# EasyEDA Pro project BQ76930_2023-08-07_15-58-00(1).eprj

# Schematic 原理图5.0
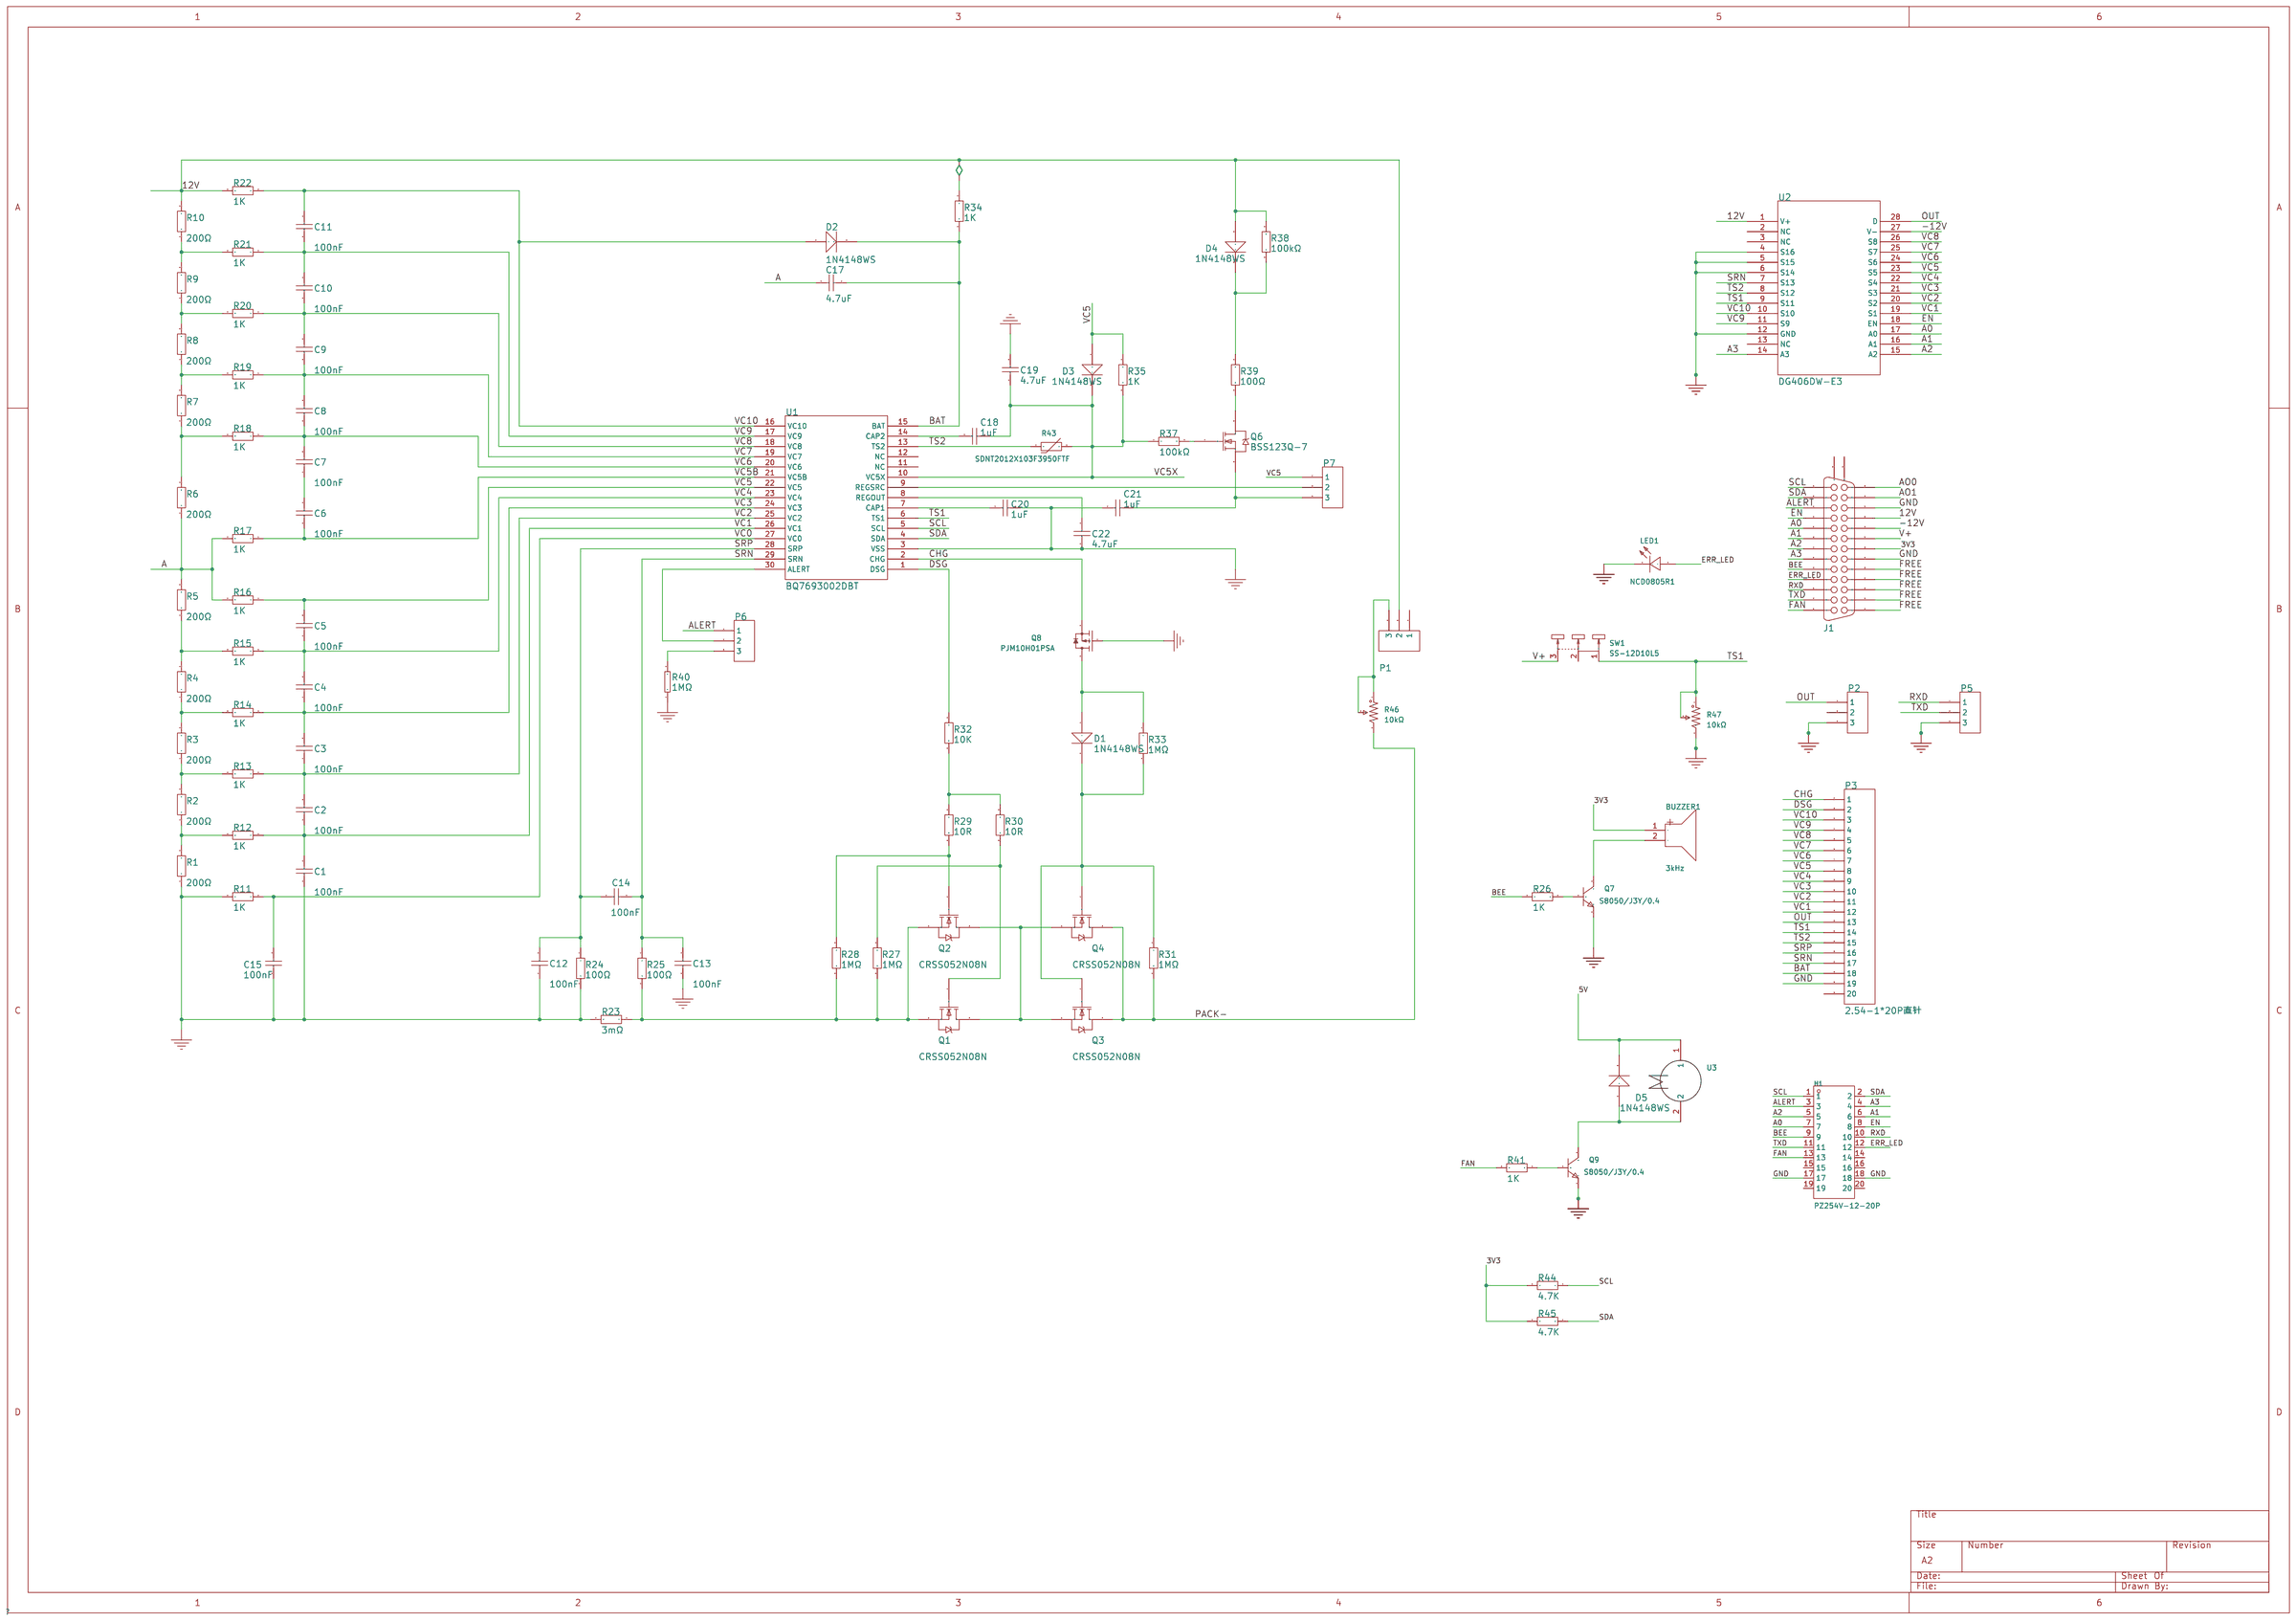
[diagram p0: schematic sheet]

## Parts
BUZZER1  3kHz  [BUZ-TH_BD9.0-P5.00-D0.6-FD]
C1  100nF  [C1206]
C2  100nF  [C1206]
C3  100nF  [C1206]
C4  100nF  [C1206]
C5  100nF  [C1206]
C6  100nF  [C1206]
C7  100nF  [C1206]
C8  100nF  [C1206]
C9  100nF  [C1206]
C10  100nF  [C1206]
C11  100nF  [C1206]
C12  100nF  [C1206]
C13  100nF  [C1206]
C14  100nF  [C1206]
C15  100nF  [C1206]
C17  4.7uF  [C1206]
C18  1uF  [C1206]
C19  4.7uF  [C1206]
C20  1uF  [C1206]
C21  1uF  [C1206]
C22  4.7uF  [C1206]
D1  1N4148WS  [SOD-323_L1.8-W1.3-LS2.5-RD]
D2  1N4148WS  [SOD-323_L1.8-W1.3-LS2.5-RD]
D3  1N4148WS  [SOD-323_L1.8-W1.3-LS2.5-RD]
D4  1N4148WS  [SOD-323_L1.8-W1.3-LS2.5-RD]
D5  1N4148WS  [SOD-323_L1.8-W1.3-LS2.5-RD]
H1  PZ254V-12-20P  [HDR-TH_20P-P2.54-V-M-R2-C10-S2.54]
J1  Connector 26  [TSSOP-30_L7.8-W4.4-P0.50-LS6.4-BL]  (no BOM)
LED1  NCD0805R1  [LED0805-RD_RED]
P1  EDG-2.54-3P  [HDR-TH_3P-P2.54-V-M]
P2  EDG-2.54-3P  [HDR-TH_3P-P2.54-V-M]
P3  2.54-1*20P直针  [HDR-TH_20P-P2.54-V-M-1]
P5  EDG-2.54-3P  [HDR-TH_3P-P2.54-V-M]
P6  EDG-2.54-3P  [HDR-TH_3P-P2.54-V-M]
P7  EDG-2.54-3P  [HDR-TH_3P-P2.54-V-M]
Q1  CRSS052N08N  [TO-263-2_L10.1-W9.1-P5.08-LS15.2-TL]
Q2  CRSS052N08N  [TO-263-2_L10.1-W9.1-P5.08-LS15.2-TL]
Q3  CRSS052N08N  [TO-263-2_L10.1-W9.1-P5.08-LS15.2-TL]
Q4  CRSS052N08N  [TO-263-2_L10.1-W9.1-P5.08-LS15.2-TL]
Q6  BSS123Q-7  [SOT-23-3_L2.9-W1.3-P1.90-LS2.4-BR]
Q7  S8050/J3Y/0.4  [SOT-23-3_L2.9-W1.3-P1.90-LS2.4-BR]
Q8  PJM10H01PSA  [SOT-23-3_L2.9-W1.3-P0.95-LS2.4-BR]
Q9  S8050/J3Y/0.4  [SOT-23-3_L2.9-W1.3-P1.90-LS2.4-BR]
R1  200Ω  [R1206]
R2  200Ω  [R1206]
R3  200Ω  [R1206]
R4  200Ω  [R1206]
R5  200Ω  [R1206]
R6  200Ω  [R1206]
R7  200Ω  [R1206]
R8  200Ω  [R1206]
R9  200Ω  [R1206]
R10  200Ω  [R1206]
R11  1K  [R1206]
R12  1K  [R1206]
R13  1K  [R1206]
R14  1K  [R1206]
R15  1K  [R1206]
R16  1K  [R1206]
R17  1K  [R1206]
R18  1K  [R1206]
R19  1K  [R1206]
R20  1K  [R1206]
R21  1K  [R1206]
R22  1K  [R1206]
R23  3mΩ  [R2512]
R24  100Ω  [R1206]
R25  100Ω  [R1206]
R26  1K  [R1206]
R27  1MΩ  [R1206]
R28  1MΩ  [R1206]
R29  10R  [R1206]
R30  10R  [R1206]
R31  1MΩ  [R1206]
R32  10K  [R1206]
R33  1MΩ  [R1206]
R34  1K  [R1206]
R35  1K  [R1206]
R37  100kΩ  [R1206]
R38  100kΩ  [R1206]
R39  100Ω  [R1206]
R40  1MΩ  [R1206]
R41  1K  [R1206]
R43  SDNT2012X103F3950FTF  [R0805]
R44  4.7K  [R1206]
R45  4.7K  [R1206]
R46  10kΩ  [RES-ADJ-TH_3P-L10.0-W10.0-P2.50-L]
R47  10kΩ  [RES-ADJ-TH_3P-L10.0-W10.0-P2.50-L]
SW1  SS-12D10L5  [SW-TH_SS-12D10L5]
U1  BQ7693002DBT  [bq76930底座（新）]
U2  DG406DW-E3  [SOIC-28_L17.9-W7.5-P1.27-LS10.3-BL]
U3  -  [电机（风扇）]

## Library data of the parts
BUZZER1 = HNB09A03: 驱动方式:有源(内含驱动线路);构造类型:电磁式;额定电压:3V;工作电压:1.5V~4.5V;消耗电流:30mA;频率:3kHz;声压(SPL):85dB@10cm;直径(φD):9mm;长度:-;宽度:-;高度:5.5mm;工作温度:-20℃~+70℃;; LCSC Part Name: 电磁式有源一体蜂鸣器HNB09A03; Supplier Part: C96102; Manufacturer: 华能; Supplier Footprint: 插件,D=9mm; JLCPCB Part Class: 扩展库; Datasheet: https://atta.szlcsc.com/upload/public/pdf/source/20170522/1495448326172.pdf; Supplier: LCSC; Oscillator Circuit: 有源(内含驱动线路); Technology Type: 电磁式; Rated Voltage: 3V; Operating Voltage: 1.5V~4.5V; Current Consumption: 30mA; Sound Pressure Level (SPL): 85dB@10cm; Diameter (φD): 9mm; Height: 5.5mm; Operating Temperature: -20℃~+70℃
C1-C15 = CL31B104KBCNNNC: 容值:100nF;精度:±10%;额定电压:50V;材质(温度系数):X7R;; LCSC Part Name: 100nF ±10% 50V; Supplier Part: C24497; Manufacturer: SAMSUNG(三星); Supplier Footprint: 1206; JLCPCB Part Class: Basic Part; Datasheet: https://atta.szlcsc.com/upload/public/pdf/source/20160103/1457707712356.pdf; Supplier: LCSC; Tolerance: ±10%; Voltage Rated: 50V; Temperature Coefficient: X7R; Design Item ID: Cap; Library Name: Miscellaneous Devices; Published: 8-Jun-2000; LatestRevisionDate: 17-Jul-2002; LatestRevisionNote: Re-released for DXP Platform.; PackageReference: RAD-0.3; Publisher: Altium Limited; PackageDescription: Radial Cap, Thru-Hole; 2 Leads; 0.3 in Pin Spacing
C17 C19 C22 = CL31B475KBHNNNE: 容值:4.7uF;精度:±10%;额定电压:50V;材质(温度系数):X7R;; LCSC Part Name: 4.7uF ±10% 50V; Supplier Part: C51205; Manufacturer: SAMSUNG(三星); Supplier Footprint: 1206; JLCPCB Part Class: Extended Part; Datasheet: https://atta.szlcsc.com/upload/public/pdf/source/20160103/1457707732693.pdf; Supplier: LCSC; Tolerance: ±10%; Voltage Rated: 50V; Temperature Coefficient: X7R; Design Item ID: Cap; Library Name: Miscellaneous Devices; Published: 8-Jun-2000; LatestRevisionDate: 17-Jul-2002; LatestRevisionNote: Re-released for DXP Platform.; PackageReference: RAD-0.3; Publisher: Altium Limited; PackageDescription: Radial Cap, Thru-Hole; 2 Leads; 0.3 in Pin Spacing
C18 C20 C21 = CL31B105KBHNNNE: 容值:1uF;精度:±10%;额定电压:50V;材质(温度系数):X7R;; LCSC Part Name: 1uF ±10% 50V; Supplier Part: C1848; Manufacturer: SAMSUNG(三星); Supplier Footprint: 1206; JLCPCB Part Class: Basic Part; Datasheet: https://atta.szlcsc.com/upload/public/pdf/source/20160103/1457707700211.pdf; Supplier: LCSC; Tolerance: ±10%; Voltage Rated: 50V; Temperature Coefficient: X7R; Design Item ID: Cap; Library Name: Miscellaneous Devices; Published: 8-Jun-2000; LatestRevisionDate: 17-Jul-2002; LatestRevisionNote: Re-released for DXP Platform.; PackageReference: RAD-0.3; Publisher: Altium Limited; PackageDescription: Radial Cap, Thru-Hole; 2 Leads; 0.3 in Pin Spacing
D1-D5 = 1N4148WS_C2128: 二极管配置:独立式;功率:200mW;直流反向耐压(Vr):100V;平均整流电流(Io):150mA;正向压降(Vf):1.25V@150mA;反向电流(Ir):1uA@75V;反向恢复时间(trr):4ns;工作温度:+150℃@(Tj);; LCSC Part Name: 100V 150mA 4ns T4; Supplier Part: C2128; Manufacturer: CJ(江苏长电/长晶); Supplier Footprint: SOD-323; JLCPCB Part Class: Basic Part; Datasheet: https://atta.szlcsc.com/upload/public/pdf/source/20140809/1457707208178.pdf; Supplier: LCSC; Diode Configuration: 独立式; Power Dissipation: 200mW; Reverse Voltage (Vr): 100V; Average Rectified Current (Io): 150mA; Forward Voltage (Vf@If): 1.25V@150mA; Reverse Leakage Current: 1uA@75V; Reverse Recovery Time (trr): 4ns; Operating Temperature: +150℃@(Tj); Design Item ID: Diode 1N4148; Library Name: Miscellaneous Devices; Published: 8-Jun-2000; LatestRevisionDate: 17-Jul-2002; LatestRevisionNote: Re-released for DXP Platform.; DatasheetVersion: 1997; PackageReference: DO-35; Publisher: Altium Limited; PackageDescription: Diode, Axial; Body 3.8 x 1.9 mm (LxDia. max), Lead Dia. 0.53 mm (max); Code_JEDEC: DO-204-AH; ComponentLink1Description: Manufacturer Link; ComponentLink1URL: http://www.fairchildsemi.com/; ComponentLink2Description: Datasheet; ComponentLink2URL: http://www.fairchildsemi.com/ds/1N%2F1N4148.pdf
H1 = PZ254V-12-20P: 排数:双排;总PIN位数:20;间距:2.54mm;插针结构:2x10P;行距:2.54mm;安装类型:直插;圆针/方针:方针;额定电流:-;额定电压:-;配合针长度:6mm;塑高:2.5mm;端接针长度:3mm;触头材质:黄铜;触头镀层:-;工作温度范围:-40℃~+105℃;颜色:黑色;; LCSC Part Name: 2.54mm 2x10P 直插 方针; Supplier Part: C492427; Manufacturer: XFCN(兴飞); Supplier Footprint: 直插,P=2.54mm; JLCPCB Part Class: Extended Part; Supplier: LCSC; Number of Rows: 双排; Number of Pins: 20; Pitch: 2.54mm; Pin Structure: 2x10P; Row Spacing: 2.54mm; Mounting Type: 直插; Circluar Pins/Square Pins: 方针; Length of Mating Pin: 6mm; Insulation Height: 2.5mm; Length of End Connection Pin: 3mm; Contact Material: 黄铜; Operating Temperature Range: -40℃~+105℃; Color: 黑色
J1 = Connector 26: Receptacle Header Assemby; Published: 15-Jun-2001; LatestRevisionDate: 17-Jul-2002; LatestRevisionNote: Re-released for DXP Platform.; DatasheetDocument: 1-Oct-1983; PackageDocument: B; PackageReference: 178240-4; Publisher: Altium Limited; Positions: 26; Orientation: Right Angle; Library Name: Miscellaneous Connectors
LED1 = NCD0805R1: 发光颜色:红灯;; LCSC Part Name: 红灯; Supplier Part: C84256; Manufacturer: 国星光电; Supplier Footprint: 0805; JLCPCB Part Class: 基础库; Datasheet: https://atta.szlcsc.com/upload/public/pdf/source/20200820/C84256_F0A75A43B3EAD75808600A0514C76B99.pdf; Supplier: LCSC; Emitted Color: 红灯
P1 P2 P5-P7 = PZ254V-11-03P: 排数:单排;总PIN位数:3;间距:2.54mm;插针结构:1x3P;行距:-;安装类型:直插;圆针/方针:方针;额定电流:3A;额定电压:250V;配合针长度:6mm;塑高:2.5mm;端接针长度:3mm;工作温度范围:-40℃~+105℃;颜色:黑色;; LCSC Part Name: 2.54mm 1x3P 直插 方针; Supplier Part: C2937625; Manufacturer: XFCN(兴飞); Supplier Footprint: 直插,P=2.54mm; JLCPCB Part Class: Extended Part; Datasheet: 2022-07-12/581362A/62b9d00620994b3696be7eb4af85ad72/双排排针和单排排针.pdf; Supplier: LCSC; Number of Rows: 单排; Number of Pins: 3; Pitch: 2.54mm; Pin Structure: 1x3P; Mounting Type: 直插; Circluar Pins/Square Pins: 方针; Current Rating (Max): 3A; Voltage Rating (Max): 250V; Length of Mating Pin: 6mm; Insulation Height: 2.5mm; Length of End Connection Pin: 3mm; Operating Temperature Range: -40℃~+105℃; Color: 黑色; Design Item ID: EDG-3P; Library Name: Miscellaneous ConnectorsUsers; Auther: JonesLee
P3 = 2.54-1*20P直针: 排数:单排;总PIN位数:20;间距:2.54mm;插针结构:1x20P;行距:-;安装类型:直插;圆针/方针:方针;额定电流:3A;额定电压:-;配合针长度:-;塑高:-;端接针长度:-;触头材质:黄铜;触头镀层:-;工作温度范围:-40℃~+105℃;颜色:黑色;; LCSC Part Name: 2.54mm 1x20P 直插 方针; Supplier Part: C50981; Manufacturer: BOOMELE(博穆精密); Supplier Footprint: 直插,P=2.54mm; JLCPCB Part Class: Extended Part; Supplier: LCSC; Number of Rows: 单排; Number of Pins: 20; Pitch: 2.54mm; Pin Structure: 1x20P; Mounting Type: 直插; Circluar Pins/Square Pins: 方针; Current Rating (Max): 3A; Contact Material: 黄铜; Operating Temperature Range: -40℃~+105℃; Color: 黑色; Design Item ID: Header 20; Library Name: Miscellaneous Connectors; LatestRevisionDate: 17-Jul-2002; LatestRevisionNote: Re-released for DXP Platform.; Publisher: Altium Limited
Q1-Q4 = CRSS052N08N: 类型:N沟道;漏源电压(Vdss):85V;连续漏极电流(Id):120A;功率(Pd):174W;导通电阻(RDS(on)@Vgs,Id):5.2mΩ@10V,50A;阈值电压(Vgs(th)@Id):4V@250uA;; LCSC Part Name: N沟道 85V 120A; Supplier Part: C410924; Manufacturer: CRMICRO(华润微); Supplier Footprint: TO-263; JLCPCB Part Class: Extended Part; Datasheet: https://atta.szlcsc.com/upload/public/pdf/source/20190822/C410924_66BD5E37D4621D32B3BB1F7EDAEFCEC4.pdf; Supplier: LCSC; Type: N沟道; Drain Source Voltage (Vdss): 85V; Continuous Drain Current (Id): 120A; Power Dissipation (Pd): 174W; Drain Source On Resistance (RDS(on)@Vgs,Id): 5.2mΩ@10V,50A; Gate Threshold Voltage (Vgs(th)@Id): 4V@250uA; Design Item ID: NMOS-2; Library Name: Miscellaneous Devices; Published: 8-Jun-2000; LatestRevisionDate: 17-Jul-2002; LatestRevisionNote: Re-released for DXP Platform.; DatasheetVersion: PD-9.814; PackageVersion: Feb-1997; PackageReference: TO-220AB; Publisher: Altium Limited; PackageDescription: TO, Thru-Hole, Vertical, Heatsink Mounted; 3 In-Line Leads; Pitch 2.54 mm; Note: Pin 2 is electrically connected to pin 4.; ComponentLink1Description: Manufacturer Link; ComponentLink1URL: http://www.irf.com/
Q6 = BSS123Q-7: 类型:N沟道;漏源电压(Vdss):100V;连续漏极电流(Id):170mA;功率(Pd):300mW;导通电阻(RDS(on)@Vgs,Id):6Ω@10V,170mA;阈值电压(Vgs(th)@Id):2V@7mA;; LCSC Part Name: N沟道 100V 170mA; Supplier Part: C460187; Manufacturer: DIODES(美台); Supplier Footprint: SOT-23; JLCPCB Part Class: Extended Part; Datasheet: https://atta.szlcsc.com/upload/public/pdf/source/20200529/C460187_3CA81A608CDA27DB302528E853B4868C.pdf; Supplier: LCSC; Type: N沟道; Drain Source Voltage (Vdss): 100V; Continuous Drain Current (Id): 170mA; Power Dissipation (Pd): 300mW; Drain Source On Resistance (RDS(on)@Vgs,Id): 6Ω@10V,170mA; Gate Threshold Voltage (Vgs(th)@Id): 2V@7mA; Design Item ID: NMOS-2; Library Name: Miscellaneous Devices; Published: 8-Jun-2000; LatestRevisionDate: 17-Jul-2002; LatestRevisionNote: Re-released for DXP Platform.; DatasheetVersion: PD-9.814; PackageVersion: Feb-1997; PackageReference: TO-220AB; Publisher: Altium Limited; PackageDescription: TO, Thru-Hole, Vertical, Heatsink Mounted; 3 In-Line Leads; Pitch 2.54 mm; Note: Pin 2 is electrically connected to pin 4.; ComponentLink1Description: Manufacturer Link; ComponentLink1URL: http://www.irf.com/
Q7 Q9 = S8050/J3Y/0.4: 集电极－基极反向击穿电压40V,集电极－发射极反向击穿电压25V,集电极电流IC500mA; LCSC Part Name: 小信号三极管 S8050/J3Y; Supplier Part: C5143141; Manufacturer: MOT(仁懋); Supplier Footprint: SOT-23; JLCPCB Part Class: 扩展库; Datasheet: https://atta.szlcsc.com/upload/public/pdf/source/20220824/B5587C0668AA5FB74D008695A37D017F.pdf; Supplier: LCSC
Q8 = PJM10H01PSA: 类型:P沟道;漏源电压(Vdss):100V;连续漏极电流(Id):1A;功率(Pd):500mW;导通电阻(RDS(on)@Vgs,Id):0.65mΩ@10V,1A;阈值电压(Vgs(th)@Id):2.5V@250uA;栅极电荷(Qg@Vgs):3.3nC@10V;输入电容(Ciss@Vds):-;反向传输电容(Crss@Vds):-;工作温度(最小值):-;工作温度(最大值):+150℃@(Tj);; Supplier Part: C2838029; Manufacturer: PJSEMI(平晶微); Supplier Footprint: SOT-23; JLCPCB Part Class: 扩展库; Datasheet: https://atta.szlcsc.com/upload/public/pdf/source/20211010/C2838029_E1812DA74E292497CFE1ACA0F7066A46.pdf; Supplier: LCSC; Type: P沟道; Drain Source Voltage (Vdss): 100V; Continuous Drain Current (Id): 1A; Power Dissipation (Pd): 500mW; Drain Source On Resistance (RDS(on)@Vgs,Id): 0.65mΩ@10V,1A; Gate Threshold Voltage (Vgs(th)@Id): 2.5V@250uA; Total Gate Charge (Qg@Vgs): 3.3nC@10V; Operating Temperature (Max): +150℃@(Tj)
R1-R10 = 1206W4J0201T5E: 电阻类型:厚膜电阻;阻值:200Ω;精度:±5%;功率:250mW;温度系数:±100ppm/℃;; LCSC Part Name: 厚膜电阻 200Ω ±5% 250mW; Supplier Part: C25361; Manufacturer: UNI-ROYAL(厚声); Supplier Footprint: 1206; JLCPCB Part Class: Extended Part; Datasheet: https://atta.szlcsc.com/upload/public/pdf/source/20200306/C422600_1E6D84923E4A46A82E41ADD87F860B5C.pdf; Supplier: LCSC; Type: 厚膜电阻; Tolerance: ±5%; Power(Watts): 250mW; Temperature Coefficient: ±100ppm/℃; Overload Voltage (Max): 200V; Operating Temperature Range: -55℃~+155℃; Design Item ID: Res2; Library Name: Miscellaneous Devices; Published: 8-Jun-2000; LatestRevisionDate: 17-Jul-2002; LatestRevisionNote: Re-released for DXP Platform.; PackageReference: AXIAL-0.4; Publisher: Altium Limited; PackageDescription: Axial Device, Thru-Hole; 2 Leads; 0.4 in Pin Spacing
R11-R22 R26 R34 R35 R41 = 1206W4F1001T5: Resistor; LCSC Part Name: 1KΩ(1001) ±1% 编带; Supplier Part: C4410; Manufacturer: UNI-ROYAL(厚声); Supplier Footprint: 1206; JLCPCB Part Class: Basic Part; Supplier: LCSC; Design Item ID: Res2; Library Name: Miscellaneous Devices; Published: 8-Jun-2000; LatestRevisionDate: 17-Jul-2002; LatestRevisionNote: Re-released for DXP Platform.; PackageReference: AXIAL-0.4; Publisher: Altium Limited; PackageDescription: Axial Device, Thru-Hole; 2 Leads; 0.4 in Pin Spacing
R23 = FMF25FPJR003-LHL: 阻值:3mΩ;精度:±1%;功率:2W;; LCSC Part Name: 3mΩ ±1% 2W; Supplier Part: C105382; Manufacturer: PSA(信昌电陶); Supplier Footprint: 2512; JLCPCB Part Class: Extended Part; Datasheet: https://atta.szlcsc.com/upload/public/pdf/source/20170410/1491788449623.pdf; Supplier: LCSC; Tolerance: ±1%; Power(Watts): 2W; Temperature Coefficient: ±100ppm/℃; Design Item ID: Res2; Library Name: Miscellaneous Devices; Published: 8-Jun-2000; LatestRevisionDate: 17-Jul-2002; LatestRevisionNote: Re-released for DXP Platform.; PackageReference: AXIAL-0.4; Publisher: Altium Limited; PackageDescription: Axial Device, Thru-Hole; 2 Leads; 0.4 in Pin Spacing
R24 R25 R39 = 1206W4F1000T5E: 电阻类型:厚膜电阻;阻值:100Ω;精度:±1%;功率:250mW;温度系数:±100ppm/℃;; LCSC Part Name: 厚膜电阻 100Ω ±1% 250mW; Supplier Part: C17901; Manufacturer: UNI-ROYAL(厚声); Supplier Footprint: 1206; JLCPCB Part Class: Basic Part; Datasheet: https://atta.szlcsc.com/upload/public/pdf/source/20200306/C422600_1E6D84923E4A46A82E41ADD87F860B5C.pdf; Supplier: LCSC; Type: 厚膜电阻; Tolerance: ±1%; Power(Watts): 250mW; Temperature Coefficient: ±100ppm/℃; Overload Voltage (Max): 200V; Operating Temperature Range: -55℃~+155℃; Design Item ID: Res2; Library Name: Miscellaneous Devices; Published: 8-Jun-2000; LatestRevisionDate: 17-Jul-2002; LatestRevisionNote: Re-released for DXP Platform.; PackageReference: AXIAL-0.4; Publisher: Altium Limited; PackageDescription: Axial Device, Thru-Hole; 2 Leads; 0.4 in Pin Spacing
R27 R28 R31 R33 = 1206W4F1004T5E: 电阻类型:厚膜电阻;阻值:1MΩ;精度:±1%;功率:250mW;温度系数:±100ppm/℃;; LCSC Part Name: 厚膜电阻 1MΩ ±1% 250mW; Supplier Part: C17927; Manufacturer: UNI-ROYAL(厚声); Supplier Footprint: 1206; JLCPCB Part Class: Basic Part; Datasheet: https://atta.szlcsc.com/upload/public/pdf/source/20200306/C422600_1E6D84923E4A46A82E41ADD87F860B5C.pdf; Supplier: LCSC; Type: 厚膜电阻; Tolerance: ±1%; Power(Watts): 250mW; Temperature Coefficient: ±100ppm/℃; Overload Voltage (Max): 200V; Operating Temperature Range: -55℃~+155℃; Design Item ID: Res2; Library Name: Miscellaneous Devices; Published: 8-Jun-2000; LatestRevisionDate: 17-Jul-2002; LatestRevisionNote: Re-released for DXP Platform.; PackageReference: AXIAL-0.4; Publisher: Altium Limited; PackageDescription: Axial Device, Thru-Hole; 2 Leads; 0.4 in Pin Spacing
R29 R30 = 1206W4F100JT5E: Resistor; LCSC Part Name: 10Ω(10R0) ±1% 编带; Supplier Part: C17903; Manufacturer: UNI-ROYAL(厚声); Supplier Footprint: 1206; JLCPCB Part Class: Basic Part; Supplier: LCSC; Design Item ID: Res2; Library Name: Miscellaneous Devices; Published: 8-Jun-2000; LatestRevisionDate: 17-Jul-2002; LatestRevisionNote: Re-released for DXP Platform.; PackageReference: AXIAL-0.4; Publisher: Altium Limited; PackageDescription: Axial Device, Thru-Hole; 2 Leads; 0.4 in Pin Spacing
R32 = 1206W4F1002T5E: Resistor; LCSC Part Name: 10KΩ(1002) ±1% 编带; Supplier Part: C17902; Manufacturer: UNI-ROYAL(厚声); Supplier Footprint: 1206; JLCPCB Part Class: Basic Part; Supplier: LCSC; Design Item ID: Res2; Library Name: Miscellaneous Devices; Published: 8-Jun-2000; LatestRevisionDate: 17-Jul-2002; LatestRevisionNote: Re-released for DXP Platform.; PackageReference: AXIAL-0.4; Publisher: Altium Limited; PackageDescription: Axial Device, Thru-Hole; 2 Leads; 0.4 in Pin Spacing
R37 R38 = 1206W4F1003T5E: 精度:±1%;阻值:100kΩ;温度系数:±100ppm/℃;功率:1/4W;最大工作电压:200V;工作温度范围:-55℃~+155℃;; LCSC Part Name: 100KΩ ±1%; Supplier Part: C17900; Manufacturer: UNI-ROYAL(厚声); Supplier Footprint: 1206; JLCPCB Part Class: Basic Part; Supplier: LCSC; Tolerance: ±1%; Temperature Coefficient: ±100ppm/℃; Power(Watts): 1/4W; Overload Voltage (Max): 200V; Operating Temperature Range: -55℃~+155℃; Design Item ID: Res2; Library Name: Miscellaneous Devices; Published: 8-Jun-2000; LatestRevisionDate: 17-Jul-2002; LatestRevisionNote: Re-released for DXP Platform.; PackageReference: AXIAL-0.4; Publisher: Altium Limited; PackageDescription: Axial Device, Thru-Hole; 2 Leads; 0.4 in Pin Spacing
R40 = 1206W4F1004T5E: 电阻类型:厚膜电阻;阻值:1MΩ;精度:±1%;功率:250mW;温度系数:±100ppm/℃;; LCSC Part Name: 厚膜电阻 1MΩ ±1% 250mW; Supplier Part: C17927; Manufacturer: UNI-ROYAL(厚声); Supplier Footprint: 1206; JLCPCB Part Class: Basic Part; Datasheet: https://atta.szlcsc.com/upload/public/pdf/source/20200306/C422600_1E6D84923E4A46A82E41ADD87F860B5C.pdf; Supplier: LCSC; Type: 厚膜电阻; Tolerance: ±1%; Power(Watts): 250mW; Temperature Coefficient: ±100ppm/℃; Overload Voltage (Max): 200V; Operating Temperature Range: -55℃~+155℃; Design Item ID: RES; Library Name: 3.RF-JDSK-G  接口单元电路图3
R43 = SDNT2012X103F3950FTF: 阻值(25℃):10kΩ;电阻精度:±1%;B值精度:±1%;B值(25℃/50℃):3950K;功率:200mW;最大稳态电流(25℃):440uA;B值(25℃/75℃):-;B值(25℃/85℃):-;B值(25℃/100℃):-;工作温度:-55℃~+125℃;; LCSC Part Name: 10kΩ 电阻精度:±1% 3950K; Supplier Part: C95968; Manufacturer: Sunlord(顺络); Supplier Footprint: 0805; JLCPCB Part Class: 扩展库; Datasheet: https://atta.szlcsc.com/upload/public/pdf/source/20210916/BF106A3565EDFEB141CB3E0EA3A661F8.pdf; Supplier: LCSC; Resistance @ 25℃: 10kΩ; Resistance Tolerance: ±1%; B Constant Tolerance: ±1%; B Constant (25℃/50℃): 3950K; Power: 200mW; Steady State Current (Max): 440uA; Operating Temperature: -55℃~+125℃
R44 R45 = 1206W4F4701T5E: Resistor; LCSC Part Name: 4.7KΩ(4701) ±1% 编带; Supplier Part: C17936; Manufacturer: UNI-ROYAL(厚声); Supplier Footprint: 1206; JLCPCB Part Class: Basic Part; Supplier: LCSC; Design Item ID: Res2; Library Name: Miscellaneous Devices; Published: 8-Jun-2000; LatestRevisionDate: 17-Jul-2002; LatestRevisionNote: Re-released for DXP Platform.; PackageReference: AXIAL-0.4; Publisher: Altium Limited; PackageDescription: Axial Device, Thru-Hole; 2 Leads; 0.4 in Pin Spacing
R46 R47 = 3296W-1-103: 阻值:10kΩ;精度:±10%;; LCSC Part Name: 10kΩ ±10%; Supplier Part: C118954; Manufacturer: BOCHEN(博晨); Supplier Footprint: 插件; JLCPCB Part Class: Extended Part; Datasheet: https://atta.szlcsc.com/upload/public/pdf/source/20171114/C118954_15106326646611117443.pdf; Supplier: LCSC; Tolerance: ±10%
SW1 = SS-12D10L5: 额定电流(DC):3A;额定电压(DC):125V;额定电流(AC):3A;额定电压(AC):125V;电路结构:单刀双掷;安装方式:直插;机械寿命:1万次;开关颜色:黑色;; LCSC Part Name: 柄长5mm 直插双档 滑动开关 大电流; Supplier Part: C319012; Manufacturer: XKB Connectivity(中国星坤); Supplier Footprint: 插件; JLCPCB Part Class: 扩展库; Datasheet: https://atta.szlcsc.com/upload/public/pdf/source/20211009/D6412F37AABE6F9459A6EE7FA4DAEADB.pdf; Supplier: LCSC; Current Rating (DC): 3A; Voltage Rating (DC): 125V; Current Rating (AC): 3A; Voltage Rating (AC): 125V; Circuit: 单刀双掷; Mounting Style: 直插; Mechanical Life: 1万次; Actuator Color: 黑色; Actuator Style: 矩形柱状; Pin Style: PC引脚; Operating Temperature: -40℃~+85℃; Switch Length: 13mm; Switch Width: 6.8mm; Switch Height: 6.4mm
U1 = BQ7693002DBT: BQ76930 bqMAXIMO：用于 5/10/15 系列锂离子和磷酸盐电池的 μC 控制 AFE 系列; Supplier Part: C202241; Manufacturer: TI(德州仪器); Supplier Footprint: TSSOP-30-4.4mm; JLCPCB Part Class: Extended Part; Datasheet: https://www.ti.com/cn/lit/gpn/bq76920; Supplier: LCSC; Design Item ID: BQ76930; Library Name: 3.RF-JDSK-G  接口单元电路图3
U2 = DG406DW-E3: 开关电路:-;; Supplier Part: C426318; Manufacturer: VISHAY(威世); Supplier Footprint: SOIC-28-300mil; JLCPCB Part Class: Extended Part; Datasheet: https://atta.szlcsc.com/upload/public/pdf/source/20190909/C426318_4D7A6E51B73E3E0F23A2F647A346ABFA.pdf; Supplier: LCSC; Digi-Key_Part_Number_1: DG406DW-E3-ND; Mfr_Name: Vishay; Type: Type
U3 = 直流电机（风扇）

## Nets
3V3: BUZZER1.1(+) J1.20 R44.2 R45.2
5V: D5.2(K) U3.1
12V: D4.1(A) J1.23 P1.2 R10.2 R22.2 R34.1 R38.1 U2.1(V+)
-12V: J1.22 U2.27(V-)
GND: C1.1 C12.1 C13.1 C15.1 C19.1 C20.1 C21.2 C22.2 H1.17 H1.18 J1.19 J1.24 LED1.1(-) P2.3 P3.19 P5.3 Q7.2(E) Q8.1(G) Q9.2(E) R1.1 R11.2 R23.2 R24.2 R40.1 R47.3 U1.3(VSS) U2.4(S16) U2.5(S15) U2.6(S14) U2.12(GND)
A: C17.2 R5.2 R6.1 R16.2 R17.2
A0: H1.7 J1.5 U2.17(A0)
A1: H1.6 J1.6 U2.16(A1)
A2: H1.5 J1.7 U2.15(A2)
A3: H1.4 J1.8 U2.14(A3)
ALERT: H1.3 J1.3 P6.1
AO0: J1.26
AO1: J1.25
BAT: C17.1 D2.2(K) P3.18 R34.2 U1.15(BAT)
BEE: H1.9 J1.9 R26.2
CHG: P3.1 Q8.2(S) U1.2(CHG)
DSG: P3.2 R32.1 U1.1(DSG)
EN: H1.8 J1.4 U2.18(EN)
ERR_LED: H1.12 J1.10 LED1.2(+)
FAN: H1.13 J1.13 R41.2
FREE: J1.14 J1.15 J1.16 J1.17 J1.18
OUT: P2.1 P3.13 U2.28(D)
PACK-: Q3.2(D) Q4.2(D) R31.2 R46.3
RXD: H1.10 J1.11 P5.1
SCL: H1.1 J1.1 R44.1 U1.5(SCL)
SDA: H1.2 J1.2 R45.1 U1.4(SDA)
SRN: C13.2 C14.1 P3.17 R25.1 U1.29(SRN) U2.7(S13)
SRP: C12.2 C14.2 P3.16 R24.1 U1.28(SRP)
TS1: P3.14 R47.1 R47.2 SW1.1 U1.6(TS1) U2.9(S11)
TS2: P3.15 R43.1 U1.13(TS2) U2.8(S12)
TXD: H1.11 J1.12 P5.2
V+: J1.21 SW1.3
VC0: C15.2 R11.1 U1.27(VC0)
VC1: C1.2 C2.1 P3.12 R12.1 U1.26(VC1) U2.19(S1)
VC2: C2.2 C3.1 P3.11 R13.1 U1.25(VC2) U2.20(S2)
VC3: C3.2 C4.1 P3.10 R14.1 U1.24(VC3) U2.21(S3)
VC4: C4.2 C5.1 P3.9 R15.1 U1.23(VC4) U2.22(S4)
VC5: C5.2 D3.1(A) P3.8 P7.1 R16.1 R35.1 U1.22(VC5) U2.23(S5)
VC5B: C6.1 R17.1 U1.21(VC5B)
VC5X: C18.1 C19.2 D3.2(K) R35.2 R37.1 R43.2 U1.10(VC5X)
VC6: C7.2 C8.1 P3.7 R18.1 U1.20(VC6) U2.24(S6)
VC7: C8.2 C9.1 P3.6 R19.1 U1.19(VC7) U2.25(S7)
VC8: C9.2 C10.1 P3.5 R20.1 U1.18(VC8) U2.26(S8)
VC9: C10.2 C11.1 P3.4 R21.1 U1.17(VC9) U2.11(S9)
VC10: C11.2 D2.1(A) P3.3 R22.1 U1.16(VC10) U2.10(S10)
$1N1493: R1.2 R2.1 R12.2
$1N1494: R2.2 R3.1 R13.2
$1N1495: R3.2 R4.1 R14.2
$1N1496: R4.2 R5.1 R15.2
$1N1497: R6.2 R7.1 R18.2
$1N1498: R7.2 R8.1 R19.2
$1N1499: R8.2 R9.1 R20.2
$1N1500: R9.2 R10.1 R21.2
$1N1534: Q1.3(S) Q2.3(S) R23.1 R25.2 R27.2 R28.2
$1N1539: P6.2 U1.30(ALERT)
$1N1540: P6.3 R40.2
$1N1545: Q2.1(G) R28.1 R29.2
$1N1547: Q1.1(G) R27.1 R30.2
$1N1562: C20.2 U1.7(CAP1)
$1N1563: C22.1 U1.8(REGOUT)
$1N1568: C18.2 U1.14(CAP2)
$1N1570: R29.1 R30.1 R32.2
$1N1571: Q1.2(D) Q2.2(D) Q3.3(S) Q4.3(S)
$1N1576: D1.2(K) Q3.1(G) Q4.1(G) R31.1 R33.2
$1N1588: Q6.1(G) R37.2
$1N1589: D4.2(K) R38.2 R39.1
$1N1761: C6.2 C7.1
$1N1767: Q6.2(D) R39.2
$1N6165: Q7.1(B) R26.1
$1N9995: BUZZER1.2(-) Q7.3(C)
$1N10020: D1.1(A) Q8.3(D) R33.1
$1N10057: Q9.1(B) R41.1
$1N18142: P7.2 U1.9(REGSRC)
$1N18151: C21.1 P7.3 Q6.3(S)
$1N18543: D5.1(A) Q9.3(C) U3.2
$1N18874: P1.3 R46.1 R46.2

Not connected (* = marked no-connect by the designer): H1 14 15 16 19 20; J1 27(MH1) 28(MH2); P1 1; P2 2; P3 20; SW1 2; U1 11(NC) 12(NC); U2 2(NC) 3(NC) 13(NC)

# Board Canvas_Temple1
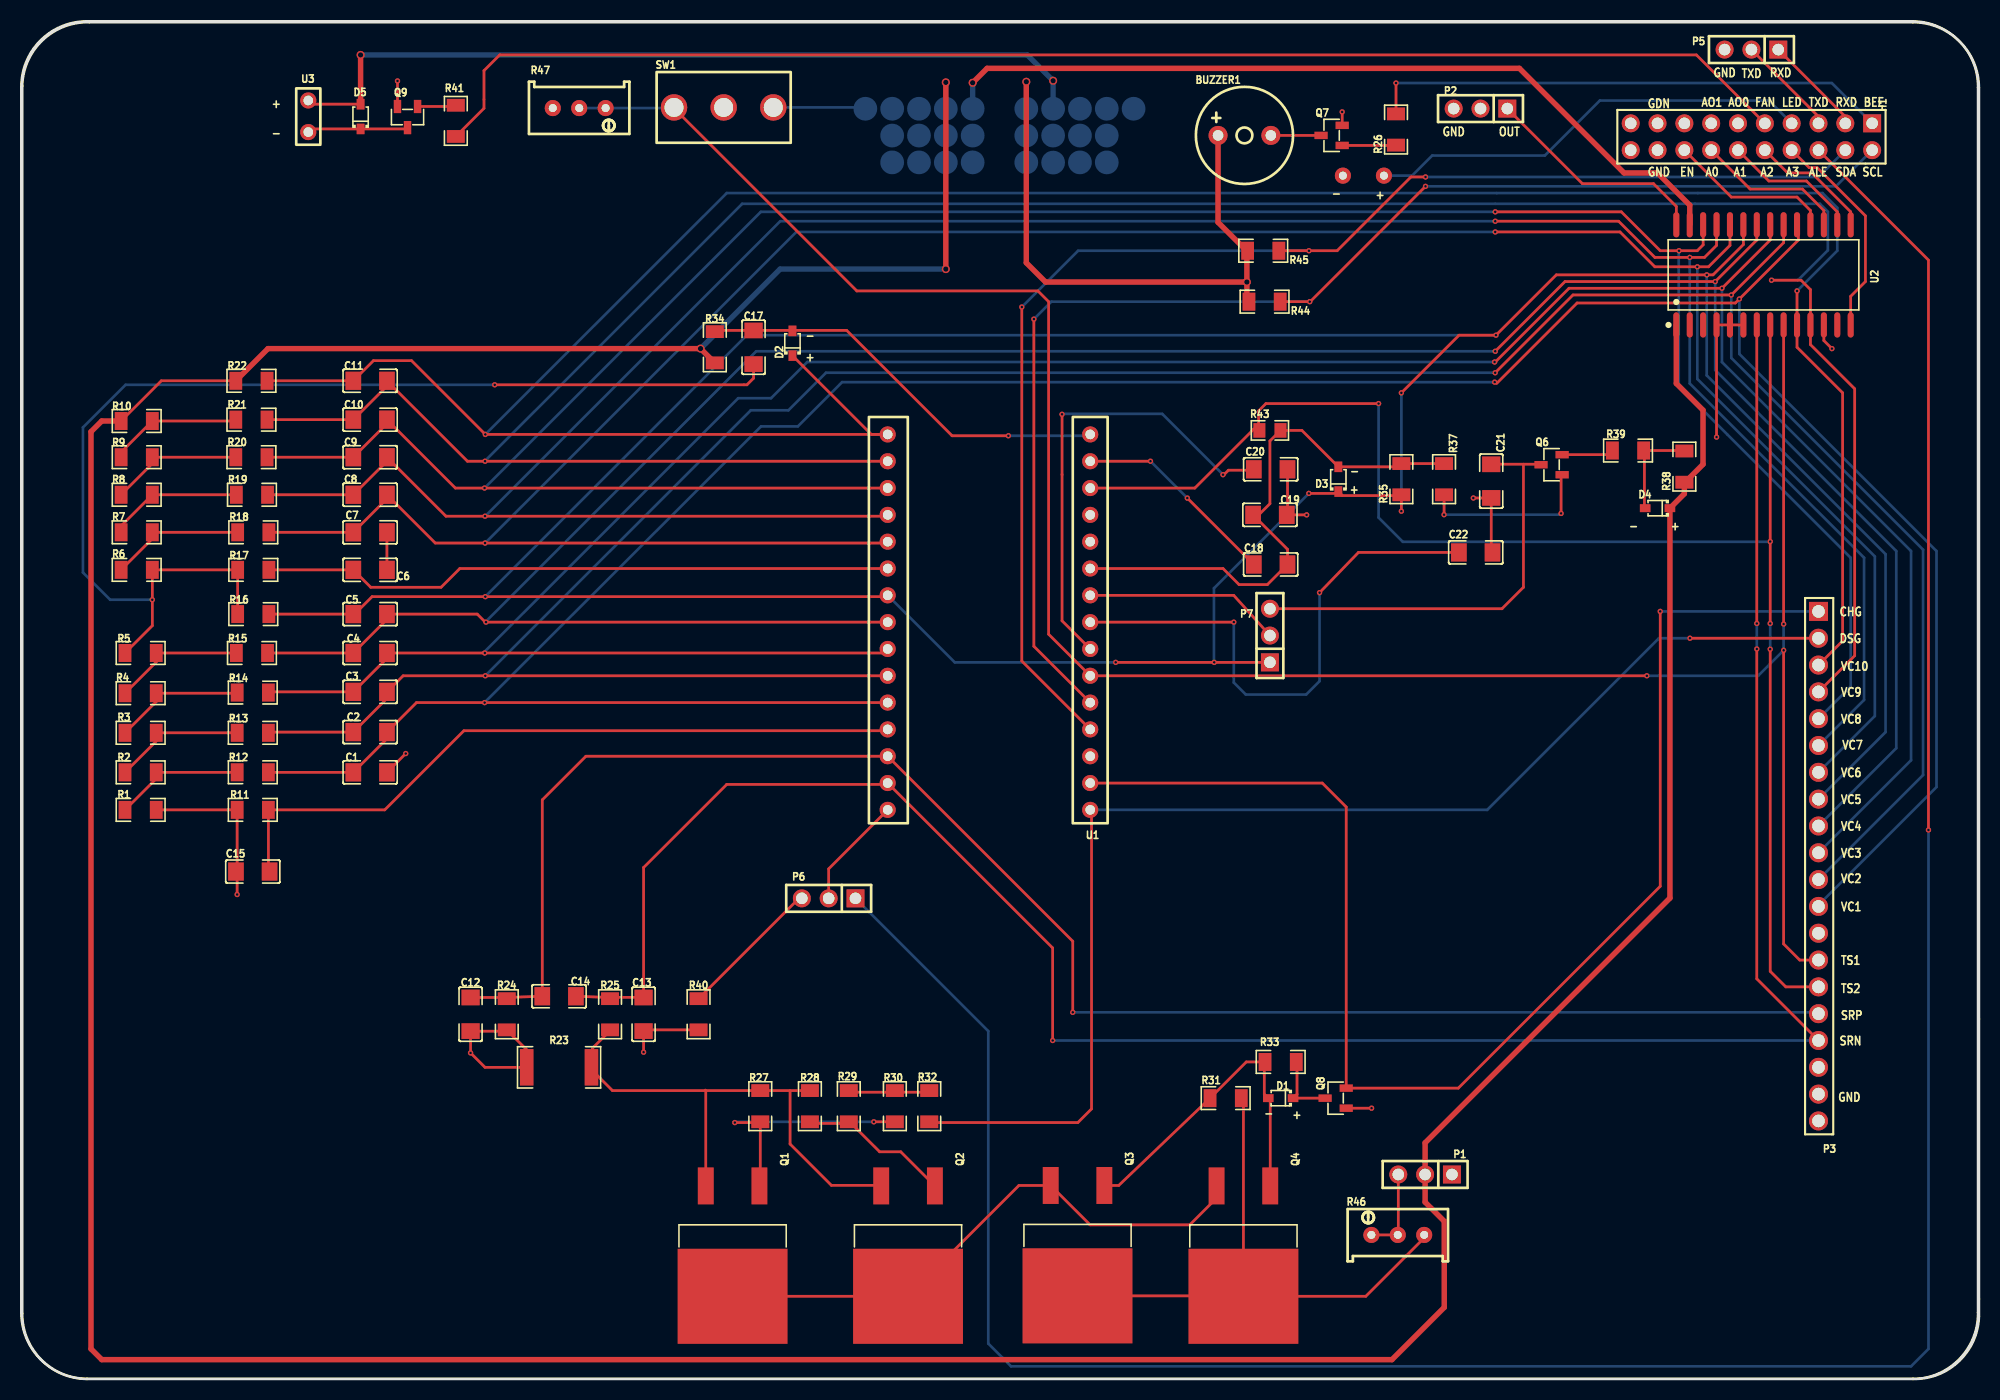
[diagram p1: board, top side]
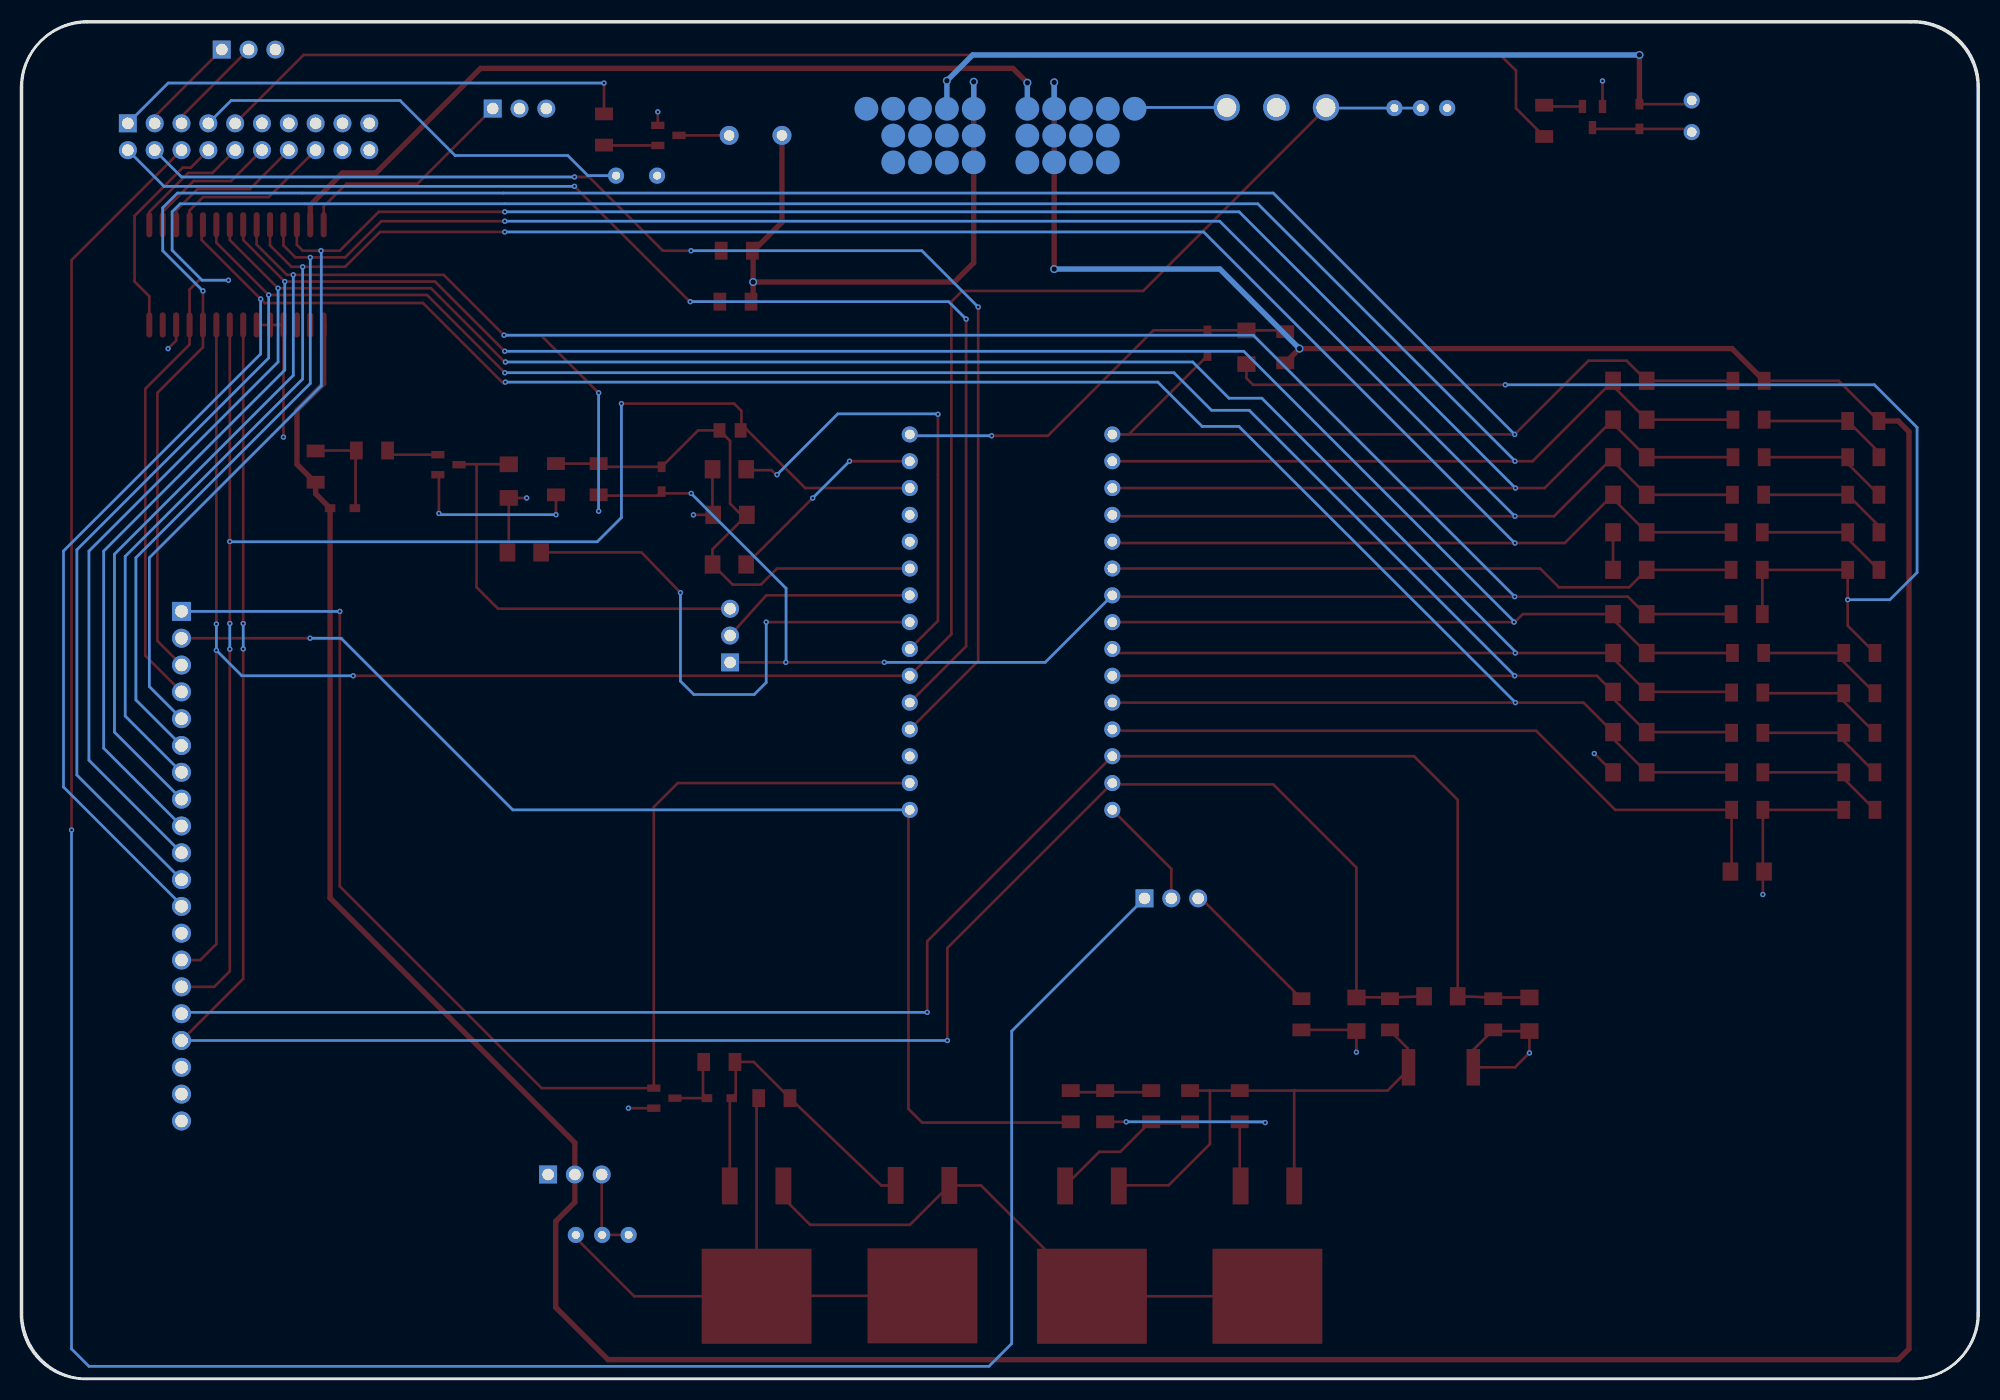
[diagram p2: board, bottom side, seen from below]

Outline 185.38 x 128.6 mm; copper layers: Top Layer, Bottom Layer. Coordinates in mm from the lower left corner of the outline.
Outline path: 6.14,0 179.14,0 ; 179.14,0 6.24,0 ; 179.14,0 arc(183.51,1.88) 185.28,6.3 185.28,122.3 arc(183.51,126.72) 179.14,128.6 6.14,128.6 arc(1.77,126.72) 0,122.3 0,6.3 arc(1.82,1.86) 6.24,0 ; 179.14,0 arc(183.49,1.68) 185.38,5.94 185.38,122.28 arc(183.54,126.69) 179.12,128.5 6.45,128.5 arc(2.02,126.79) 0.1,122.46 0.1,6.2 arc(1.89,1.83) 6.24,0
Stack: Top Layer 0.0356mm / Dielectric1 0.508mm FR-4 er 4.2 / Bottom Layer 0.0356mm

## Design rules (mm)
template: 用户自定义配置
spacing Clearance_Poly (default): track to track 0.099, other pairs 0 to 0.099
spacing Clearance: track to track 0.099, other pairs 0 to 0.099
track width Width (default): min 0.254, default 0.508, max 0.508
track width 12V: min 0.254, default 0.508, max 0.508
track width -12V: min 0.254, default 0.508, max 0.508
track width 3V3: min 0.254, default 0.508, max 0.508
differential pair DiffPairsRouting (default): width min 0.381, default 0.381, max 0.381; gap min 0.201, default 0.3
via RoutingVias (default): diameter min 0.508, default 0.508, max 0.762; hole min 0.254, default 0.254, max 0.508

## Placement (name value [footprint] x y rotation side)
BUZZER1  3kHz  [BUZ-TH_BD9.0-P5.00-D0.6-FD]  115.84 117.78 0 top
C1  100nF  [C1206]  33.05 57.45 180 top
C2  100nF  [C1206]  33.05 61.26 180 top
C3  100nF  [C1206]  33.05 65.07 180 top
C4  100nF  [C1206]  33.05 68.75 180 top
C5  100nF  [C1206]  33.05 72.44 180 top
C6  100nF  [C1206]  33.05 76.63 0 top
C7  100nF  [C1206]  33.05 80.18 180 top
C8  100nF  [C1206]  33.05 83.74 180 top
C9  100nF  [C1206]  33.05 87.3 180 top
C10  100nF  [C1206]  33.05 90.85 180 top
C11  100nF  [C1206]  33.05 94.53 180 top
C12  100nF  [C1206]  42.56 34.53 90 top
C13  100nF  [C1206]  58.94 34.53 90 top
C14  100nF  [C1206]  50.94 36.24 180 top
C15  100nF  [C1206]  21.93 48.05 0 top
C17  4.7uF  [C1206]  69.36 97.71 270 top
C18  1uF  [C1206]  118.32 77.14 180 top
C19  4.7uF  [C1206]  118.25 81.83 180 top
C20  1uF  [C1206]  118.32 86.15 180 top
C21  1uF  [C1206]  139.2 85.03 270 top
C22  4.7uF  [C1206]  137.73 78.28 0 top
D1  1N4148WS  [SOD-323_L1.8-W1.3-LS2.5-RD]  119.27 26.59 180 top
D2  1N4148WS  [SOD-323_L1.8-W1.3-LS2.5-RD]  73.04 98.09 90 top
D3  1N4148WS  [SOD-323_L1.8-W1.3-LS2.5-RD]  124.73 85.21 90 top
D4  1N4148WS  [SOD-323_L1.8-W1.3-LS2.5-RD]  154.95 82.47 180 top
D5  1N4148WS  [SOD-323_L1.8-W1.3-LS2.5-RD]  32.14 119.56 90 top
H1  PZ254V-12-20P  [HDR-TH_20P-P2.54-V-M-R2-C10-S2.54]  163.84 117.65 180 top
NOREF  -  [Pad_ie20]  85.02 117.76 0 top
NOREF#2  -  [Pad_ie14]  79.94 120.3 0 top
NOREF#3  -  [Pad_e17797]  125.16 113.97 180 top
NOREF#4  -  [Pad_ie25]  87.56 115.22 0 top
NOREF#5  -  [Pad_ie5]  105.34 120.3 0 top
NOREF#6  -  [Pad_ie13]  82.48 120.3 0 top
NOREF#7  -  [Pad_ie24]  82.48 115.22 0 top
NOREF#8  -  [Pad_ie19]  90.1 115.22 0 top
NOREF#9  -  [Pad_ie9]  95.18 120.3 0 top
NOREF#10  -  [Pad_ie21]  100.26 115.22 0 top
NOREF#11  -  [Pad_ie22]  97.72 117.76 0 top
NOREF#12  -  [Pad_ie23]  82.48 117.76 0 top
NOREF#13  -  [Pad_ie11]  87.56 120.3 0 top
NOREF#14  -  [Pad_ie27]  100.26 117.76 0 top
NOREF#15  -  [Pad_ie12]  85.02 120.3 0 top
NOREF#16  -  [Pad_ie7]  100.26 120.3 0 top
NOREF#17  -  [Pad_ie10]  90.1 120.3 0 top
NOREF#18  -  [Pad_ie26]  97.72 115.2 0 top
NOREF#19  -  [Pad_ie28]  87.56 117.76 0 top
NOREF#20  -  [Pad_ie8]  97.72 120.3 0 top
NOREF#21  -  [Pad_e17795]  129.05 113.97 180 top
NOREF#22  -  [Pad_ie15]  102.8 115.22 0 top
NOREF#23  -  [Pad_ie29]  90.1 117.76 0 top
NOREF#24  -  [Pad_ie6]  102.8 120.3 0 top
NOREF#25  -  [Pad_ie16]  95.18 115.22 0 top
NOREF#26  -  [Pad_ie17]  95.18 117.76 0 top
NOREF#27  -  [Pad_ie30]  85.02 115.22 0 top
NOREF#28  -  [Pad_ie18]  102.8 117.76 0 top
P1  EDG-2.54-3P  [HDR-TH_3P-P2.54-V-M]  132.94 19.36 180 top
P2  EDG-2.54-3P  [HDR-TH_3P-P2.54-V-M]  138.19 120.32 180 top
P3  2.54-1*20P直针  [HDR-TH_20P-P2.54-V-M-1]  170.19 48.56 270 top
P5  EDG-2.54-3P  [HDR-TH_3P-P2.54-V-M]  163.84 125.9 180 top
P6  EDG-2.54-3P  [HDR-TH_3P-P2.54-V-M]  76.47 45.51 180 top
P7  EDG-2.54-3P  [HDR-TH_3P-P2.54-V-M]  118.25 70.4 90 top
Q1  CRSS052N08N  [TO-263-2_L10.1-W9.1-P5.08-LS15.2-TL]  67.37 13.05 270 top
Q2  CRSS052N08N  [TO-263-2_L10.1-W9.1-P5.08-LS15.2-TL]  83.98 13.05 270 top
Q3  CRSS052N08N  [TO-263-2_L10.1-W9.1-P5.08-LS15.2-TL]  100.03 13.09 270 top
Q4  CRSS052N08N  [TO-263-2_L10.1-W9.1-P5.08-LS15.2-TL]  115.74 13.05 270 top
Q6  BSS123Q-7  [SOT-23-3_L2.9-W1.3-P1.90-LS2.4-BR]  144.92 86.59 0 top
Q7  S8050/J3Y/0.4  [SOT-23-3_L2.9-W1.3-P1.90-LS2.4-BR]  124.09 117.78 0 top
Q8  PJM10H01PSA  [SOT-23-3_L2.9-W1.3-P0.95-LS2.4-BR]  124.47 26.59 0 top
Q9  S8050/J3Y/0.4  [SOT-23-3_L2.9-W1.3-P1.90-LS2.4-BR]  36.59 119.51 90 top
R1  200Ω  [R1206]  11.32 53.89 180 top
R2  200Ω  [R1206]  11.32 57.45 180 top
R3  200Ω  [R1206]  11.32 61.19 180 top
R4  200Ω  [R1206]  11.32 64.94 180 top
R5  200Ω  [R1206]  11.32 68.75 180 top
R6  200Ω  [R1206]  10.94 76.63 180 top
R7  200Ω  [R1206]  10.94 80.18 180 top
R8  200Ω  [R1206]  10.94 83.74 180 top
R9  200Ω  [R1206]  10.94 87.3 180 top
R10  200Ω  [R1206]  10.94 90.72 180 top
R11  1K  [R1206]  21.93 53.89 180 top
R12  1K  [R1206]  21.93 57.45 180 top
R13  1K  [R1206]  21.93 61.19 180 top
R14  1K  [R1206]  21.93 65 180 top
R15  1K  [R1206]  21.86 68.75 180 top
R16  1K  [R1206]  21.98 72.44 180 top
R17  1K  [R1206]  21.98 76.63 180 top
R18  1K  [R1206]  21.98 80.18 180 top
R19  1K  [R1206]  21.86 83.74 180 top
R20  1K  [R1206]  21.81 87.3 180 top
R21  1K  [R1206]  21.81 90.85 180 top
R22  1K  [R1206]  21.81 94.53 180 top
R23  3mΩ  [R2512]  50.94 29.51 180 top
R24  100Ω  [R1206]  45.99 34.53 270 top
R25  100Ω  [R1206]  55.77 34.53 270 top
R26  1K  [R1206]  130.19 118.33 90 top
R27  1MΩ  [R1206]  69.99 25.83 90 top
R28  1MΩ  [R1206]  74.69 25.83 90 top
R29  10R  [R1206]  78.37 25.83 270 top
R30  10R  [R1206]  82.73 25.83 270 top
R31  1MΩ  [R1206]  114.06 26.59 0 top
R32  10K  [R1206]  85.99 25.83 90 top
R33  1MΩ  [R1206]  119.27 30.02 180 top
R34  1K  [R1206]  65.69 97.71 90 top
R35  1K  [R1206]  130.7 85.21 90 top
R37  100kΩ  [R1206]  134.74 85.21 270 top
R38  100kΩ  [R1206]  157.49 86.41 90 top
R39  100Ω  [R1206]  152.16 87.93 180 top
R40  1MΩ  [R1206]  64.15 34.53 90 top
R41  1K  [R1206]  41.16 119.15 270 top
R43  SDNT2012X103F3950FTF  [R0805]  118.25 89.84 0 top
R44  4.7K  [R1206]  117.74 102.03 180 top
R45  4.7K  [R1206]  117.61 106.85 180 top
R46  10kΩ  [RES-ADJ-TH_3P-L10.0-W10.0-P2.50-L]  130.36 13.64 0 top
R47  10kΩ  [RES-ADJ-TH_3P-L10.0-W10.0-P2.50-L]  52.84 120.36 180 top
SW1  SS-12D10L5  [SW-TH_SS-12D10L5]  66.52 120.43 0 top
U1  BQ7693002DBT  [bq76930底座（新）]  101.23 53.89 180 top
U2  DG406DW-E3  [SOIC-28_L17.9-W7.5-P1.27-LS10.3-BL]  164.99 104.57 0 top
U3  -  [电机（风扇）]  27.19 121.09 270 top

## Footprints (pads in the part's own frame, mm; a bottom-side part is the same pattern mirrored in y, then rotated)
bq76930底座（新）
  round 1.524 hole 0.914: 1(0,0) 2(0,-2.54) 3(0,-5.08) 4(0,-7.62) 5(0,-10.16) 6(0,-12.7) 7(0,-15.24) 8(0,-17.78) 9(0,-20.32) 10(0,-22.86) 11(0,-25.4) 12(0,-27.94) 13(0,-30.48) 14(0,-33.02) 15(0,-35.56) 16(19.177,-35.56) 17(19.177,-33.02) 18(19.177,-30.48) 19(19.177,-27.94) 20(19.177,-25.4) 21(19.177,-22.86) 22(19.177,-20.32) 23(19.177,-17.78) 24(19.177,-15.24) 25(19.177,-12.7) 26(19.177,-10.16) 27(19.177,-7.62) 28(19.177,-5.08) 29(19.177,-2.54) 30(19.177,0)
BUZ-TH_BD9.0-P5.00-D0.6-FD
  round 1.8 hole 1: 1(-2.5,0) 2(2.5,0)
C1206
  rect 1.485x1.728 smd: 1(-1.593,0) 2(1.593,0)
HDR-TH_3P-P2.54-V-M
  rect 1.7x1.7 hole 1.1: 1(-2.54,0)
  round 1.7 hole 1.1: 2(0,0) 3(2.54,0)
HDR-TH_20P-P2.54-V-M-1
  rect 1.8x1.8 hole 1.2: 1(-24.13,0)
  round 1.8 hole 1.2: 2(-21.59,0) 3(-19.05,0) 4(-16.51,0) 5(-13.97,0) 6(-11.43,0) 7(-8.89,0) 8(-6.35,0) 9(-3.81,0) 10(-1.27,0) 11(1.27,0) 12(3.81,0) 13(6.35,0) 14(8.89,0) 15(11.43,0) 16(13.97,0) 17(16.51,0) 18(19.05,0) 19(21.59,0) 20(24.13,0)
HDR-TH_20P-P2.54-V-M-R2-C10-S2.54
  rect 1.7x1.7 hole 1.1: 1(-11.43,-1.27)
  round 1.7 hole 1.1: 2(-11.43,1.27) 3(-8.89,-1.27) 4(-8.89,1.27) 5(-6.35,-1.27) 6(-6.35,1.27) 7(-3.81,-1.27) 8(-3.81,1.27) 9(-1.27,-1.27) 10(-1.27,1.27) 11(1.27,-1.27) 12(1.27,1.27) 13(3.81,-1.27) 14(3.81,1.27) 15(6.35,-1.27) 16(6.35,1.27) 17(8.89,-1.27) 18(8.89,1.27) 19(11.43,-1.27) 20(11.43,1.27)
Pad_e17795
  round 1.524 hole 0.762: 1(0,0)
Pad_e17797
  round 1.524 hole 0.762: 1(0,0)
Pad_ie5
  round 2.25 smd far side: 0(0,0)
Pad_ie6
  round 2.25 smd far side: 0(0,0)
Pad_ie7
  round 2.25 smd far side: 0(0,0)
Pad_ie8
  round 2.25 smd far side: 0(0,0)
Pad_ie9
  round 2.25 smd far side: 0(0,0)
Pad_ie10
  round 2.25 smd far side: 0(0,0)
Pad_ie11
  round 2.25 smd far side: 0(0,0)
Pad_ie12
  round 2.25 smd far side: 0(0,0)
Pad_ie13
  round 2.25 smd far side: 0(0,0)
Pad_ie14
  round 2.25 smd far side: 0(0,0)
Pad_ie15
  round 2.25 smd far side: 0(0,0)
Pad_ie16
  round 2.25 smd far side: 0(0,0)
Pad_ie17
  round 2.25 smd far side: 0(0,0)
Pad_ie18
  round 2.25 smd far side: 0(0,0)
Pad_ie19
  round 2.25 smd far side: 0(0,0)
Pad_ie20
  round 2.25 smd far side: 0(0,0)
Pad_ie21
  round 2.25 smd far side: 0(0,0)
Pad_ie22
  round 2.25 smd far side: 0(0,0)
Pad_ie23
  round 2.25 smd far side: 0(0,0)
Pad_ie24
  round 2.25 smd far side: 0(0,0)
Pad_ie25
  round 2.25 smd far side: 0(0,0)
Pad_ie26
  round 2.25 smd far side: 0(0,0)
Pad_ie27
  round 2.25 smd far side: 0(0,0)
Pad_ie28
  round 2.25 smd far side: 0(0,0)
Pad_ie29
  round 2.25 smd far side: 0(0,0)
Pad_ie30
  round 2.25 smd far side: 0(0,0)
R0805
  rect 1.133x1.377 smd: 1(-1,0) 2(1,0)
R1206
  rect 1.208x1.701 smd: 1(-1.479,0) 2(1.479,0)
R2512
  rect 1.282x3.456 smd: 1(-3.067,0) 2(3.067,0)
RES-ADJ-TH_3P-L10.0-W10.0-P2.50-L
  round 1.524 hole 0.762: 1(-2.5,0) 2(0,0) 3(2.5,0)
SOD-323_L1.8-W1.3-LS2.5-RD
  rect 1x0.75 smd: 1(-1.173,0) 2(1.173,0)
SOIC-28_L17.9-W7.5-P1.27-LS10.3-BL
  oval 0.574x2.388 smd: 1(-8.255,-4.744) 2(-6.985,-4.744) 3(-5.715,-4.744) 4(-4.445,-4.744) 5(-3.175,-4.744) 6(-1.905,-4.744) 7(-0.635,-4.744) 8(0.635,-4.744) 9(1.905,-4.744) 10(3.175,-4.744) 11(4.445,-4.744) 12(5.715,-4.744) 13(6.985,-4.744) 14(8.255,-4.744) 15(8.255,4.744) 16(6.985,4.744) 17(5.715,4.744) 18(4.445,4.744) 19(3.175,4.744) 20(1.905,4.744) 21(0.635,4.744) 22(-0.635,4.744) 23(-1.905,4.744) 24(-3.175,4.744) 25(-4.445,4.744) 26(-5.715,4.744) 27(-6.985,4.744) 28(-8.255,4.744)
SOT-23-3_L2.9-W1.3-P0.95-LS2.4-BR
  rect 1.25x0.7 smd: 1(1,-0.95) 2(1,0.95) 3(-1,0)
SOT-23-3_L2.9-W1.3-P1.90-LS2.4-BR
  rect 1.25x0.7 smd: 1(1,-0.95) 2(1,0.95) 3(-1,0)
SW-TH_SS-12D10L5
  round 2.5 hole 1.8: 1(-4.7,0) 2(0,0) 3(4.7,0)
TO-263-2_L10.1-W9.1-P5.08-LS15.2-TL
  rect 3.5x1.5 smd: 1(-5.228,2.54) 3(-5.228,-2.54)
  rect 9x10.4 smd: 2(5.228,0)
电机（风扇）
  round 1.524 hole 0.914: 1(0,0) 2(2.995,0)

## Nets
3V3: BUZZER1.1 NOREF#9.0 R44.2 R45.2
5V: D5.2 NOREF#20.0 U3.1
12V: D4.1 NOREF#13.0 P1.2 R10.2 R22.2 R34.1 R38.1 U2.1
-12V: NOREF#17.0 U2.27
GND: C1.1 C12.1 C13.1 C15.1 C19.1 C20.1 C21.2 C22.2 H1.17 H1.18 NOREF#3.1 NOREF#15.0 NOREF#16.0 P2.3 P3.19 P5.3 Q7.2 Q8.1 Q9.2 R1.1 R11.2 R23.2 R24.2 R40.1 R47.3 U1.3 U2.4 U2.5 U2.6 U2.12
A: C17.2 R5.2 R6.1 R16.2 R17.2
A0: H1.14 U2.17
A1: H1.12 U2.16
A2: H1.10 U2.15
A3: H1.8 U2.14
ALERT: H1.6 P6.1
BAT: C17.1 D2.2 R34.2 U1.15
BEE: H1.1 R26.2
CHG: P3.1 Q8.2 U1.2
DSG: P3.2 R32.1 U1.1
EN: H1.16 U2.18
ERR_LED: H1.7 NOREF#21.1
FAN: H1.9 R41.2
IO0: NOREF#22.0
IO1: NOREF#10.0
IO2: NOREF#18.0
IO3: NOREF#25.0
IO4: NOREF#8.0
IO5: NOREF#4.0
IO6: NOREF#27.0
IO7: NOREF#7.0
IO8: NOREF#28.0
IO9: NOREF#14.0
IO10: NOREF#11.0
IO11: NOREF#26.0
IO12: NOREF#23.0
IO13: NOREF#19.0
IO14: NOREF.0
IO15: NOREF#12.0
OUT: P2.1 U2.28
PACK-: Q3.2 Q4.2 R31.2 R46.3
RXD: H1.3 P5.1
SCL: H1.2 R44.1 U1.5
SDA: H1.4 R45.1 U1.4
SRN: C13.2 C14.1 P3.17 R25.1 U1.29 U2.7
SRP: C12.2 C14.2 P3.16 R24.1 U1.28
TS1: P3.14 R47.1 R47.2 SW1.1 U1.6 U2.9
TS2: P3.15 R43.1 U1.13 U2.8
TXD: H1.5 P5.2
USB_D+: NOREF#24.0
USB_D-: NOREF#5.0
V+: NOREF#2.0 SW1.3
VC0: C15.2 R11.1 U1.27
VC1: C1.2 C2.1 P3.12 R12.1 U1.26 U2.19
VC2: C2.2 C3.1 P3.11 R13.1 U1.25 U2.20
VC3: C3.2 C4.1 P3.10 R14.1 U1.24 U2.21
VC4: C4.2 C5.1 P3.9 R15.1 U1.23 U2.22
VC5: C5.2 D3.1 P3.8 P7.1 R16.1 R35.1 U1.22 U2.23
VC5B: C6.1 R17.1 U1.21
VC5X: C18.1 C19.2 D3.2 R35.2 R37.1 R43.2 U1.10
VC6: C7.2 C8.1 P3.7 R18.1 U1.20 U2.24
VC7: C8.2 C9.1 P3.6 R19.1 U1.19 U2.25
VC8: C9.2 C10.1 P3.5 R20.1 U1.18 U2.26
VC9: C10.2 C11.1 P3.4 R21.1 U1.17 U2.11
VC10: C11.2 D2.1 P3.3 R22.1 U1.16 U2.10
VOUT-_USR: NOREF#6.0
$1N1493: R1.2 R2.1 R12.2
$1N1494: R2.2 R3.1 R13.2
$1N1495: R3.2 R4.1 R14.2
$1N1496: R4.2 R5.1 R15.2
$1N1497: R6.2 R7.1 R18.2
$1N1498: R7.2 R8.1 R19.2
$1N1499: R8.2 R9.1 R20.2
$1N1500: R9.2 R10.1 R21.2
$1N1534: Q1.3 Q2.3 R23.1 R25.2 R27.2 R28.2
$1N1539: P6.2 U1.30
$1N1540: P6.3 R40.2
$1N1545: Q2.1 R28.1 R29.2
$1N1547: Q1.1 R27.1 R30.2
$1N1562: C20.2 U1.7
$1N1563: C22.1 U1.8
$1N1568: C18.2 U1.14
$1N1570: R29.1 R30.1 R32.2
$1N1571: Q1.2 Q2.2 Q3.3 Q4.3
$1N1576: D1.2 Q3.1 Q4.1 R31.1 R33.2
$1N1588: Q6.1 R37.2
$1N1589: D4.2 R38.2 R39.1
$1N1761: C6.2 C7.1
$1N1767: Q6.2 R39.2
$1N6165: Q7.1 R26.1
$1N9995: BUZZER1.2 Q7.3
$1N10020: D1.1 Q8.3 R33.1
$1N10057: Q9.1 R41.1
$1N18142: P7.2 U1.9
$1N18151: C21.1 P7.3 Q6.3
$1N18543: D5.1 Q9.3 U3.2
$1N18874: P1.3 R46.1 R46.2

Pads without a net: H1 11 13 15 19 20; P1 1; P2 2; P3 13 18 20; SW1 2; U1 11 12; U2 2 3 13

## Via types
v1: diameter 0.508, hole 0.254, Top Layer to Bottom Layer, 78 vias
v2: diameter 0.762, hole 0.508, Top Layer to Bottom Layer, 8 vias

## Routing (per net, layer and track width the routed paths; a pad name or vN(x,y) marks a point on that pad's centre or on a via; arc(x,y) is an arc through that point)
3V3:
  vias: v2(95.18,122.86) v2(116.07,103.89)
5V: length 5.1
  Top Layer w0.254: U3.1 27.54,120.73 D5.2
  vias: v2(32.14,125.4) v2(97.72,122.95)
12V: length 12.4
  Top Layer w0.254: R22.2 13.28,94.53 R10.2
  vias: v2(64.33,97.58) v2(87.56,122.8) v2(87.56,105.11)
-12V:
  vias: v2(90.1,122.76)
GND: length 76.2
  Top Layer w0.254: 20.46,48.17 v1(20.45,45.88) ; 20.46,48.17 R11.2 R1.1 ; 20.46,48.17 C15.1 ; C1.1 v1(36.42,59.23) ; Q9.2 v1(35.64,122.93) ; 45.99,32.98 45.94,32.93 42.56,32.93 v1(42.56,30.88) 43.92,29.51 R23.2 47.87,31.17 R24.2 ; 58.94,32.93 v1(58.94,30.94) ; R40.1 58.94,33.06 ; v1(121.72,81.83) C19.1 119.92,81.91 119.92,86.15 ; 125.09,118.73 v1(125.09,120) ; Q8.1 v1(127.87,25.64) ; C21.2 139.21,78.4 C22.2 ; 139.21,83.43 v1(137.51,83.43) ; v1(160.54,89.2) U2.4 U2.6 ; U2.12 170.7,98.35 v1(171.46,97.58)
A: length 109.4
  Top Layer w0.254: R16.2 R17.2 R6.1 v1(12.42,73.8) 12.42,71.34 R5.2 ; v1(44.84,94.15) 68.73,94.15 69.36,94.78 C17.2
  Bottom Layer w0.254: v1(44.84,94.15) 9.89,94.15 5.86,90.12 5.86,76.37 8.43,73.8 v1(12.42,73.8)
ALERT: length 255.8
  Top Layer w0.254: H1.6 180.61,105.97 v1(180.61,51.99)
  Bottom Layer w0.254: P6.1 91.58,32.94 91.58,3.35 93.74,1.19 178.96,1.19 180.61,2.84 v1(180.61,51.99)
BAT: length 39.8
  Top Layer w0.254: R34.2 65.81,99.31 72.99,99.31 ; 72.99,99.31 D2.2 ; 72.99,99.31 78.17,99.31 88.15,89.33 v1(93.48,89.33)
  Bottom Layer w0.254: v1(93.48,89.33) 101.11,89.33 U1.15
BEE: length 49.6
  Top Layer w0.254: R26.2 v1(130.19,122.74)
  Bottom Layer w0.254: v1(130.19,122.74) 171.46,122.74 H1.1
CHG: length 130.5
  Top Layer w0.254: U1.2 123.2,56.44 125.47,54.17 125.47,27.54 136.09,27.54 155.21,46.66 v1(155.21,72.69)
  Bottom Layer w0.254: v1(155.21,72.69) P3.1
DSG: length 120
  Top Layer w0.254: 85.99,24.28 100.06,24.28 101.36,25.57 101.36,53.77 U1.1 ; P3.2 v1(158.02,70.15)
  Bottom Layer w0.254: U1.1 138.82,53.9 155.08,70.15 v1(158.02,70.15)
SCL: length 127.2
  Top Layer w0.254: v1(95.9,100.38) 95.9,69.39 U1.5 ; 119.27,102.03 v1(122.02,102.03) 122.06,102.03 v1(132.98,112.95)
  Bottom Layer w0.254: v1(95.9,100.38) 97.55,102.03 121.97,102.03 ; v1(132.98,112.95) 171.84,112.95 H1.2
SDA: length 129.7
  Top Layer w0.254: v1(94.76,101.52) 94.76,67.99 U1.4 ; 119.13,106.85 v1(121.95,106.85) 124.62,106.85 131.6,113.84 v1(132.98,113.84)
  Bottom Layer w0.254: v1(94.76,101.52) 100.09,106.85 121.97,106.85 ; v1(132.98,113.84) 170.19,113.84 172.73,116.38
SRN: length 218.7
  Top Layer w0.254: C14.1 55.5,36.13 55.51,36.14 58.94,36.14 58.94,48.43 66.82,56.31 81.93,56.31 U1.29 97.68,40.81 v1(97.68,32.05) ; U2.7 v1(164.35,71.55) ; v1(164.35,69.13) 164.35,37.89 P3.17
  Bottom Layer w0.254: v1(97.68,32.05) P3.17 ; v1(164.35,71.55) v1(164.35,69.13)
SRP: length 161.7
  Top Layer w0.254: C12.2 45.72,36.13 ; 45.99,36.13 C14.2 49.35,54.84 53.48,58.98 U1.28 99.58,41.45 v1(99.58,34.72)
  Bottom Layer w0.254: v1(99.58,34.72) 170.07,34.72 P3.16
TS1: length 218.5
  Top Layer w0.254: SW1.1 61.82,120.36 79.13,103.04 96.28,103.04 97.3,102.03 97.3,70.53 U1.6 v1(153.94,66.59) ; v1(166.89,71.49) U2.9 ; v1(166.89,69.01) 166.89,41.2 168.42,39.67 P3.14
  Bottom Layer w0.254: R47.2 R47.1 61.78,120.36 61.86,120.44 ; v1(153.94,66.59) 164.48,66.6 v1(166.89,69.01) v1(166.89,71.49)
TS2: length 147.1
  Top Layer w0.254: 101.36,84.5 101.49,84.38 111.14,84.38 116.73,89.96 117.38,89.96 ; 117.18,89.84 117.18,91.69 117.87,92.38 v1(128.54,92.38) ; U2.8 v1(165.62,71.55) ; v1(165.62,69.11) 165.62,38.61 167.1,37.13 P3.15
  Bottom Layer w0.254: v1(128.54,92.38) 128.54,81.58 130.83,79.29 165.62,79.29 ; v1(165.62,71.55) v1(165.62,69.11)
  vias: v1(165.62,79.31)
VC0: length 67.7
  Top Layer w0.254: U1.27 81.93,61.39 41.92,61.39 34.43,53.9 R11.1 23.41,48.17 C15.2
VC1: length 275.4
  Top Layer w0.254: U1.26 37.43,64.06 C2.1 34.64,60.64 C1.2 23.42,57.45 R12.1 ; 139.71,94.28 147.33,101.9 162.32,101.9 168.29,107.87 168.29,109.17
  Bottom Layer w0.254: 43.87,64.06 70.07,90.22 73.55,90.22 77.74,94.41 v1(139.53,94.41) ; 162.7,102.28 162.7,97.07 181.37,78.41 181.37,56.06 170.19,44.88 P3.12
  vias: v1(43.89,64.05) v1(162.7,102.28)
VC2: length 269.9
  Top Layer w0.254: 34.65,65.07 36.17,66.6 U1.25 ; v1(139.58,95.3) 146.95,102.66 v1(161.94,102.66) 166.89,107.62 166.89,109.3 ; R13.1 23.48,61.26 C2.2 34.64,64.45 C3.1
  Bottom Layer w0.254: 43.95,66.6 69.09,91.74 72.66,91.74 76.21,95.3 v1(139.58,95.3) ; v1(161.94,102.66) 161.94,96.69 180.1,78.53 180.1,57.2 P3.11
  vias: v1(43.95,66.59)
VC3: length 264.6
  Top Layer w0.254: U1.24 81.67,68.75 C4.1 34.64,68.26 C3.2 23.48,65.07 R14.1 ; 139.59,96.31 146.57,103.3 v1(161.05,103.3) 165.62,107.87 165.62,109.3
  Bottom Layer w0.254: 43.77,68.75 67.9,92.88 71.01,92.88 74.44,96.31 v1(139.52,96.31) ; v1(161.05,103.3) 161.05,96.31 178.96,78.41 178.96,58.59 P3.10
  vias: v1(43.9,68.75)
VC4: length 259.4
  Top Layer w0.254: 34.65,72.44 43.19,72.44 43.95,71.68 U1.23 ; v1(139.59,97.33) 146.19,103.93 v1(160.41,103.93) 164.35,107.87 164.35,109.3 ; C5.1 34.64,71.94 C4.2 R15.1
  Bottom Layer w0.254: 43.95,71.68 69.61,97.33 139.63,97.33 ; v1(160.41,103.93) 160.41,95.55 177.56,78.41 177.56,59.74 P3.9
  vias: v1(44.02,71.67)
VC5: length 344.9
  Top Layer w0.254: 31.46,72.31 33.23,74.09 82.06,74.09 ; P7.1 v1(103.64,67.86) ; v1(121.93,83.87) 124.55,83.87 D3.1 125.11,83.66 130.7,83.66 v1(130.7,82.18) ; v1(130.7,93.39) 136.16,98.85 v1(139.65,98.85) 145.37,104.57 160.21,104.57 163.08,107.44 163.08,109.31 ; C5.2 R16.1
  Bottom Layer w0.254: 43.94,74.09 68.71,98.85 v1(139.65,98.85) ; U1.22 88.41,67.87 v1(103.64,67.86) ; v1(121.93,83.87) 112.95,74.88 112.95,67.87 ; v1(130.7,82.18) v1(130.7,93.39) ; 159.61,104.57 159.61,95.04 176.54,78.11 176.54,61.26 P3.8
  vias: v1(43.95,74.09) v1(112.97,67.86) v1(159.61,104.57)
VC5B: length 60
  Top Layer w0.254: U1.21 41.54,76.76 39.76,74.98 33.11,74.98 C6.1 R17.1
VC6: length 253.5
  Top Layer w0.254: U1.20 81.93,79.17 39.21,79.17 C8.1 34.64,83.37 C7.2 R18.1 ; v1(139.59,108.63) 151.4,108.63 154.7,105.33 159.78,105.33 161.81,107.36 161.81,109.31
  Bottom Layer w0.254: 43.94,79.17 73.4,108.63 v1(139.59,108.63) ; 158.72,105.33 158.72,94.7 175.53,77.9 175.53,62.79 P3.7
  vias: v1(43.93,79.17) v1(158.72,105.33)
VC7: length 249.6
  Top Layer w0.254: U1.19 81.93,81.71 40.23,81.71 C9.1 34.64,86.93 C8.2 R19.1 ; v1(139.59,109.65) 151.27,109.65 154.7,106.22 159.4,106.22 160.54,107.36 160.54,109.31
  Bottom Layer w0.254: 43.94,81.71 71.88,109.65 v1(139.59,109.65) ; v1(158,106.22) 158,94.28 174.51,77.77 174.51,64.31 P3.6
  vias: v1(43.92,81.71)
VC8: length 245.3
  Top Layer w0.254: U1.18 41.12,84.38 C10.1 34.64,90.48 C9.2 R20.1 ; v1(139.59,110.54) 151.52,110.54 155.21,106.85 158.71,106.85 159.27,107.41 159.27,109.3
  Bottom Layer w0.254: v1(43.88,84.37) 70.04,110.54 v1(139.59,110.54) ; 156.96,106.85 156.96,94.05 173.24,77.77 173.24,65.58 P3.5
  vias: v1(156.99,106.85)
VC9: length 256.8
  Top Layer w0.254: U1.17 42.26,86.92 C11.1 34.64,94.04 C10.2 R21.1 ; v1(165.75,104.06) 168.54,104.06 169.43,103.17 U2.11 ; 169.43,99.84 169.43,97.96 173.62,93.77 173.62,68.5 P3.4
  Bottom Layer w0.254: 43.89,86.92 68.28,111.3 170.32,111.3 171.08,110.54 171.08,106.9 168.25,104.06 v1(165.75,104.06)
  vias: v1(43.93,86.91)
VC10: length 259.9
  Top Layer w0.254: 31.71,94.79 33.36,96.44 36.97,96.44 v1(43.95,89.45) U1.16 80.5,89.46 D2.1 ; v1(168.16,103.04) 168.16,97.71 172.48,93.39 172.48,69.9 P3.3 ; C11.2 R22.1
  Bottom Layer w0.254: v1(43.95,89.45) 66.82,112.32 170.57,112.32 171.97,110.92 171.97,106.85 v1(168.16,103.04)
$1N1493: length 12.4
  Top Layer w0.254: R12.2 20.45,57.45 R2.1 12.8,56.85 R1.2
$1N1494: length 12.6
  Top Layer w0.254: R13.2 R3.1 12.8,60.41 R2.2
$1N1495: length 12.7
  Top Layer w0.254: R3.2 12.8,64.15 R4.1 20.39,64.94 R14.2
$1N1496: length 12.6
  Top Layer w0.254: R4.2 12.8,67.9 R5.1 R15.2
$1N1497: length 12.9
  Top Layer w0.254: R18.2 R7.1 12.42,79.58 R6.2
$1N1498: length 12.7
  Top Layer w0.254: R19.2 R8.1 9.47,80.78 R7.2
$1N1499: length 12.7
  Top Layer w0.254: R8.2 12.42,86.7 R9.1 R20.2
$1N1500: length 12.6
  Top Layer w0.254: R9.2 9.47,87.77 R10.1 20.2,90.72 R21.2
$1N1547: length 23.7
  Top Layer w0.254: R27.1 69.99,18.36 Q1.1 ; 69.99,24.28 v1(67.58,24.28) ; R30.2 v1(80.74,24.35)
  Bottom Layer w0.254: v1(67.58,24.28) 67.65,24.35 v1(80.74,24.35)
$1N1562: length 44.1
  Top Layer w0.254: 98.57,91.4 98.57,71.8 U1.7 ; v1(113.8,85.64) 113.9,85.65 114.32,86.06 116.64,86.06 C20.2
  Bottom Layer w0.254: 98.57,91.4 108.05,91.4 v1(113.8,85.64)
  vias: v1(98.57,91.36)
$1N1563: length 51.6
  Top Layer w0.254: U1.8 v1(114.83,71.67) ; v1(122.95,74.47) 126.63,78.28 C22.1
  Bottom Layer w0.254: v1(114.83,71.67) 114.83,65.95 115.96,64.82 121.68,64.82 122.95,66.09 v1(122.95,74.47)
$1N1568: length 19.6
  Top Layer w0.254: v1(106.94,86.91) U1.14 ; v1(110.43,83.42) 116.72,77.14 C18.2
  Bottom Layer w0.254: v1(106.94,86.91) 110.48,83.38
$1N1588: length 16.6
  Top Layer w0.254: 134.74,83.66 v1(134.74,81.85) ; 145.82,85.64 v1(145.82,81.97)
  Bottom Layer w0.254: v1(134.74,81.85) 145.7,81.86 v1(145.82,81.97)
$1N1761: length 3.6
  Top Layer w0.254: C7.1 C6.2
$1N10057: length 3.7
  Top Layer w0.254: Q9.1 41.04,120.51 R41.1
$1N18543: length 9.6
  Top Layer w0.254: Q9.3 36.46,118.39 D5.1 27.49,118.39 U3.2
A0: length 14.4
  Top Layer w0.254: H1.14 163.72,112.7 168.67,112.7 170.7,110.66 170.7,109.3
A1: length 13.1
  Top Layer w0.254: H1.12 165.49,113.46 169.05,113.46 171.97,110.54 171.97,109.3
A2: length 11.8
  Top Layer w0.254: H1.10 167.27,114.22 169.56,114.22 173.24,110.54 173.24,109.31
A3: length 20.5
  Top Layer w0.254: H1.8 169.3,114.73 170.07,114.73 174.64,110.16 174.64,103.93 173.24,102.54 173.24,99.84
EN: length 15.7
  Top Layer w0.254: H1.16 161.94,111.93 168.16,111.93 169.43,110.66 169.43,109.3
FAN: length 131.9
  Top Layer w0.254: R41.2 43.83,120.34 43.83,123.91 45.31,125.4 158.64,125.4 H1.9
OUT: length 21.6
  Top Layer w0.254: P2.1 147.84,113.2 154.57,113.2 156.73,111.05 156.73,109.3
PACK-: length 54.2
  Top Layer w0.254: Q3.2 115.7,7.87 Q4.2 ; Q4.2 115.74,26.52 ; Q4.2 127.33,7.82 133.14,13.64
RXD: length 9.6
  Top Layer w0.254: P5.1 172.73,119.55 172.73,118.92
TXD: length 9.6
  Top Layer w0.254: P5.2 170.19,119.55 H1.5
VC5X: length 52.5
  Top Layer w0.254: U1.10 113.81,76.76 115.33,75.23 118.01,75.23 C18.1 ; R43.2 118.25,88.84 118.25,82.9 117.19,81.84 116.65,81.84 119.92,78.57 119.92,77.14 ; 119.33,89.84 121.28,89.84 D3.2 130.39,86.39 130.7,86.69 134.73,86.69 134.76,86.66
$1N1534: length 50.4
  Top Layer w0.254: 54.09,29.51 54.09,31.31 55.77,32.98 ; 53.79,29.51 55.99,27.31 R28.2 ; 64.78,27.35 64.83,27.31 Q1.3 ; 72.81,27.31 72.81,22.25 76.72,18.34 81.39,18.34 Q2.3
$1N1539: length 10.7
  Top Layer w0.254: U1.30 76.47,48.31 P6.2
$1N1540: length 13.4
  Top Layer w0.254: R40.2 73.65,45.51
$1N1545: length 14.4
  Top Layer w0.254: R28.1 74.84,24.2 78.37,24.2 ; 78.37,24.28 78.53,24.28 81.29,21.51 83.29,21.51 Q2.1
$1N1570: length 7.6
  Top Layer w0.254: 78.37,27.15 85.99,27.15
$1N1571: length 53.9
  Top Layer w0.254: Q1.2 Q2.2 94.48,18.32 Q3.3 101.22,14.59 110.66,14.59 113.2,17.13 Q4.3
$1N1576: length 31.9
  Top Layer w0.254: Q3.1 103.93,18.32 R31.1 116.01,30.02 117.72,30.02 117.72,26.97 D1.2 118.28,26.41 Q4.1
$1N1589: length 9.5
  Top Layer w0.254: D4.2 153.71,82.54 153.71,87.93 157.49,87.93 157.62,87.8
$1N1767: length 5
  Top Layer w0.254: 145.97,87.54 150.29,87.54 R39.2 ; 151,87.74 151.06,87.8
$1N6165: length 5.1
  Top Layer w0.254: Q7.1 130.12,116.83 130.19,116.76
$1N9995: length 4.8
  Top Layer w0.254: BUZZER1.2 123.18,117.78
$1N10020: length 6.6
  Top Layer w0.254: D1.1 120.82,26.97 120.82,30.02 ; Q8.3 120.49,26.59
$1N18142: length 18.7
  Top Layer w0.254: U1.9 114.82,74.22 P7.2
$1N18151: length 40.9
  Top Layer w0.254: P7.3 140.22,72.95 142.25,74.98 142.25,86.63 ; 139.21,86.63 143.64,86.63
$1N18874: length 8.4
  Top Layer w0.254: R46.1 130.34,13.64 ; P1.3 130.41,13.73 130.19,13.51

## Copper pours and planes (outline as drawn; the poured copper is in the pictures)
GND on Bottom Layer: 0.14,128.8 185.42,128.8 185.42,0.3 0.14,0.3

## Text on the board
Top Silkscreen Layer: + | - | GND | OUT | GDN | EN | AO1 | A0 | AO0 | A1 | TXD | FAN | A2 | RXD | LED | A3 | ALE | SDA | CHG | DSG | SRN | VC10 | VC9 | VC8 | VC6 | VC5 | VC4 | VC3 | VC2 | VC1 | TS1 | TS2 | SRP | VC7 | SCL | BEE | V | O | U | T | S | R | I | _ | 1 | 7 | 5 | G | N | D | 6 | 4 | 2 | 3 | 引 | 脚 | 位 | 置 | . | 0 | 9 | B | 8
